# Altium project S7CAS-PLEIADES-CARTE-MERE.PrjPCB (part 2 of 3)

## Sheet CM_CLK.SchDoc
size Tabloid; SheetNumber: 8; SheetTotal: 14; Size: 11x17; Sheet_Name: CM_CLK
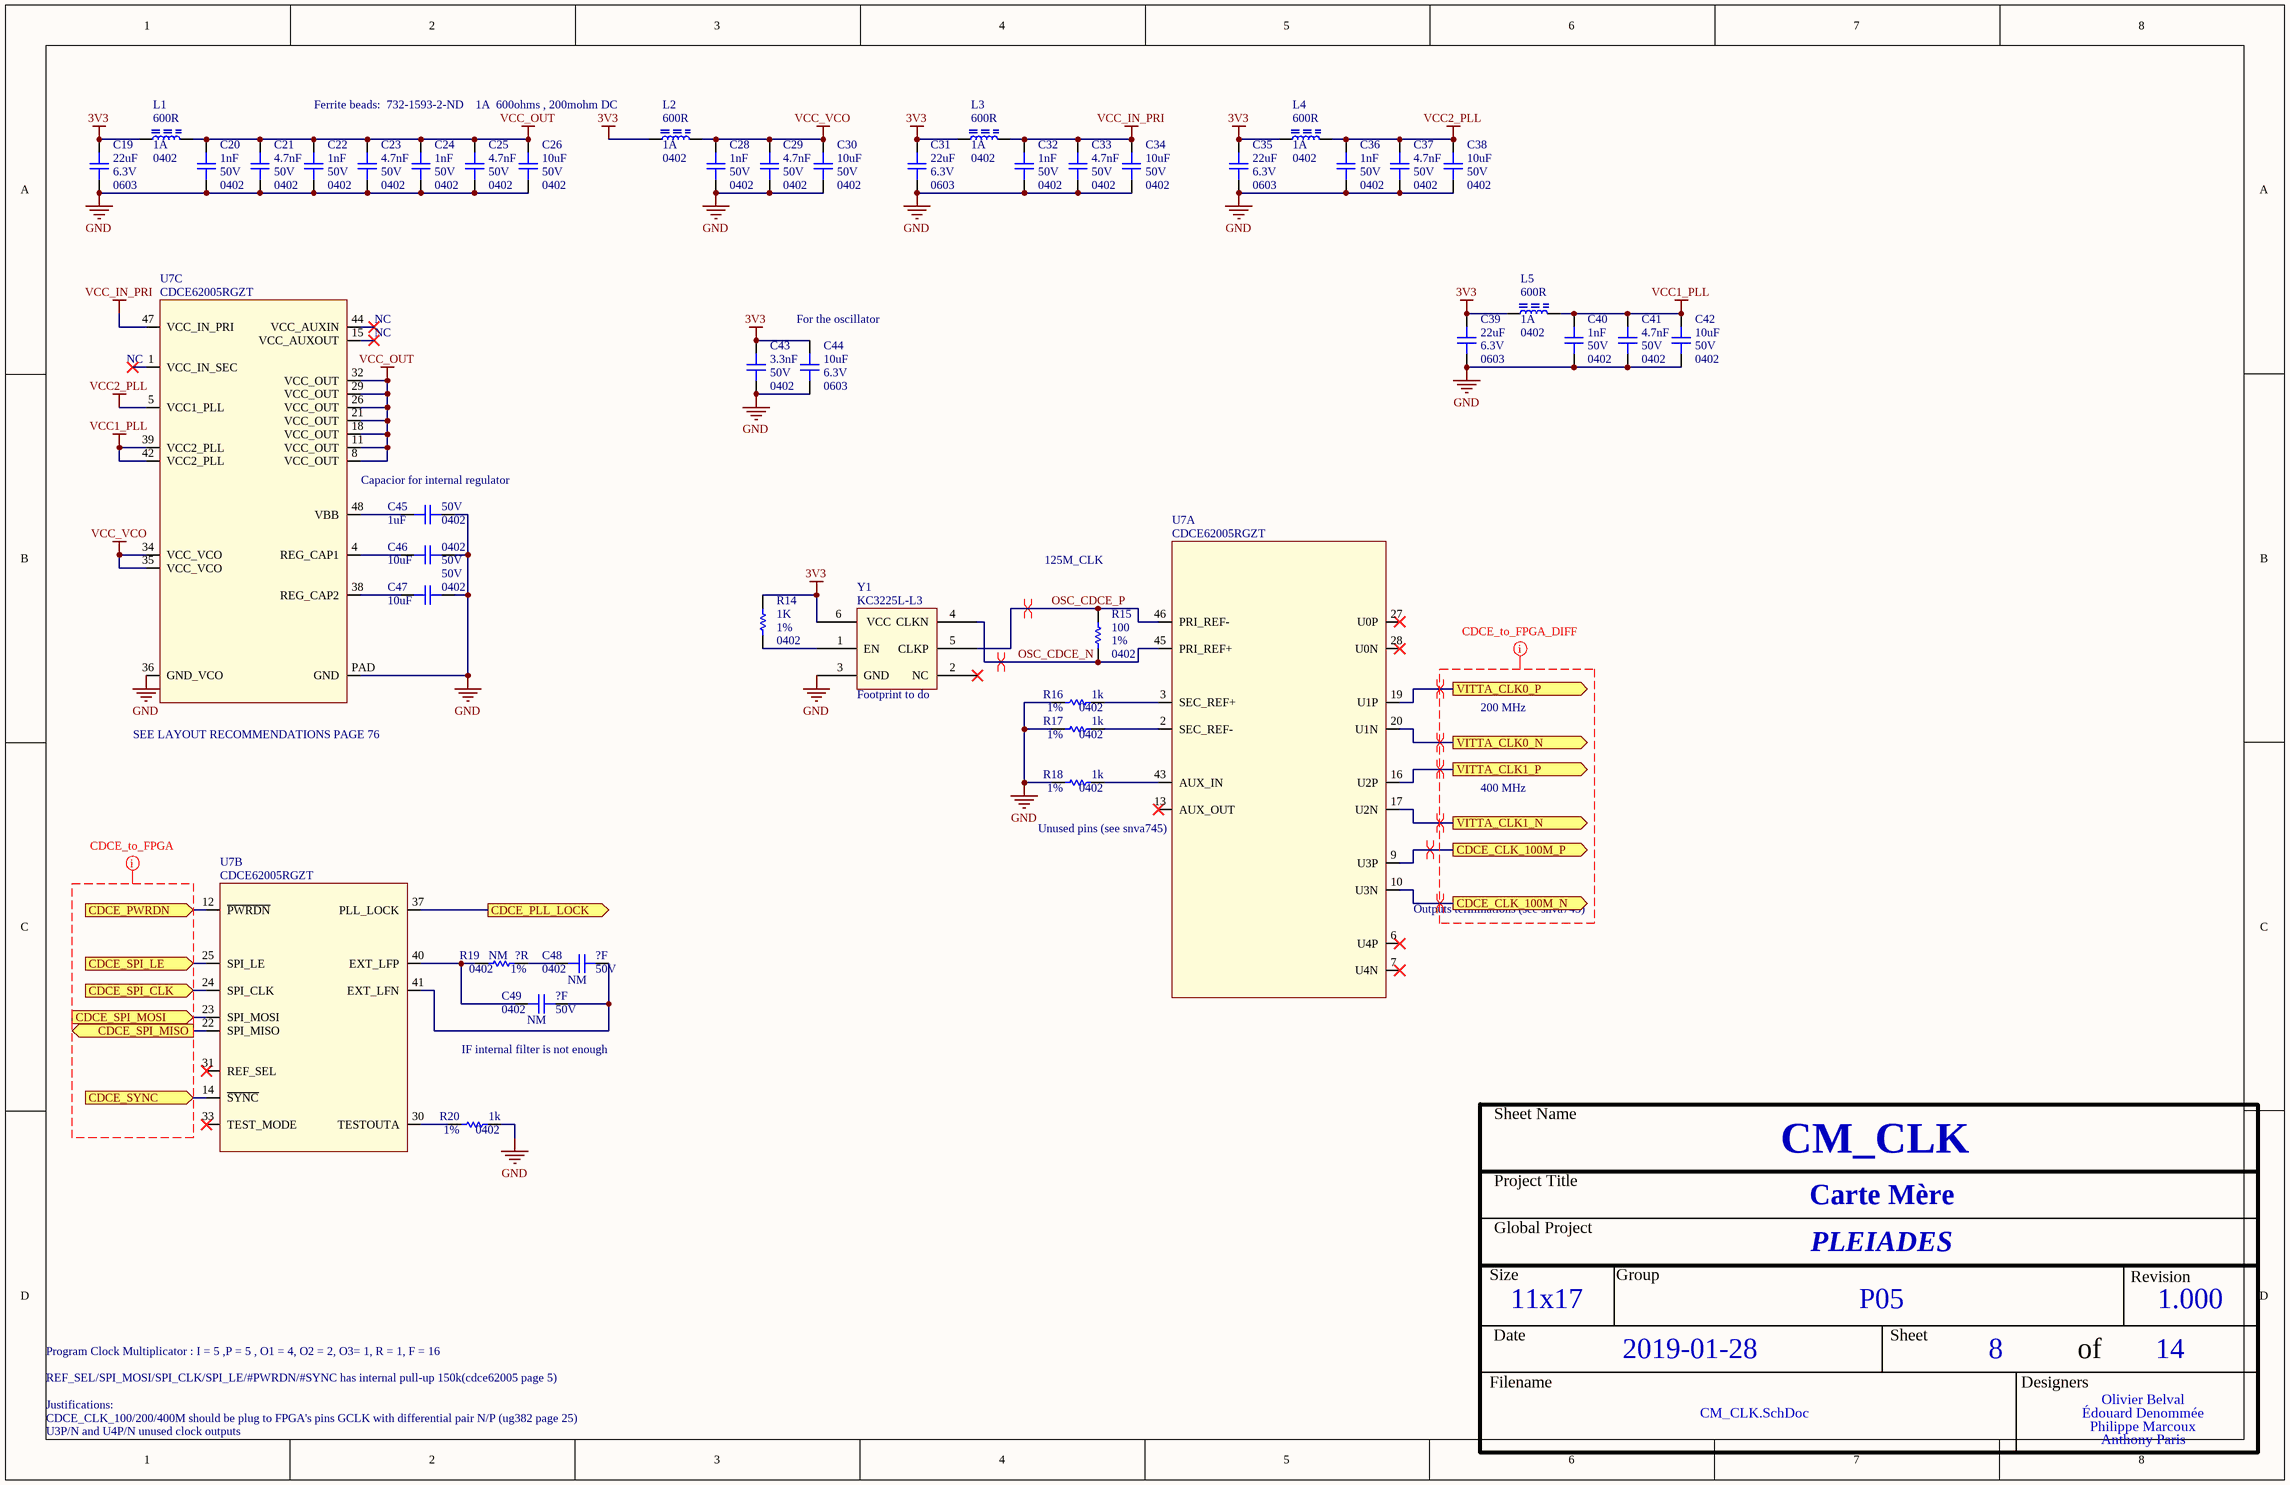
[diagram p7: CM_CLK.SchDoc]

### Parts
C19  value 22uF  Voltage: 6.3V  Package: 0603  [CAP_0603]  (hidden comment: CAP - 0603)
C20  value 1nF  Voltage: 50V  Package: 0402  [CAP_0402]  (hidden comment: CAP - 0402)
C21  value 4.7nF  Voltage: 50V  Package: 0402  [CAP_0402]  (hidden comment: CAP - 0402)
C22  value 1nF  Voltage: 50V  Package: 0402  [CAP_0402]  (hidden comment: CAP - 0402)
C23  value 4.7nF  Voltage: 50V  Package: 0402  [CAP_0402]  (hidden comment: CAP - 0402)
C24  value 1nF  Voltage: 50V  Package: 0402  [CAP_0402]  (hidden comment: CAP - 0402)
C25  value 4.7nF  Voltage: 50V  Package: 0402  [CAP_0402]  (hidden comment: CAP - 0402)
C26  value 10uF  Voltage: 50V  Package: 0402  [CAP_0402]  (hidden comment: CAP - 0402)
C28  value 1nF  Voltage: 50V  Package: 0402  [CAP_0402]  (hidden comment: CAP - 0402)
C29  value 4.7nF  Voltage: 50V  Package: 0402  [CAP_0402]  (hidden comment: CAP - 0402)
C30  value 10uF  Voltage: 50V  Package: 0402  [CAP_0402]  (hidden comment: CAP - 0402)
C31  value 22uF  Voltage: 6.3V  Package: 0603  [CAP_0603]  (hidden comment: CAP - 0603)
C32  value 1nF  Voltage: 50V  Package: 0402  [CAP_0402]  (hidden comment: CAP - 0402)
C33  value 4.7nF  Voltage: 50V  Package: 0402  [CAP_0402]  (hidden comment: CAP - 0402)
C34  value 10uF  Voltage: 50V  Package: 0402  [CAP_0402]  (hidden comment: CAP - 0402)
C35  value 22uF  Voltage: 6.3V  Package: 0603  [CAP_0603]  (hidden comment: CAP - 0603)
C36  value 1nF  Voltage: 50V  Package: 0402  [CAP_0402]  (hidden comment: CAP - 0402)
C37  value 4.7nF  Voltage: 50V  Package: 0402  [CAP_0402]  (hidden comment: CAP - 0402)
C38  value 10uF  Voltage: 50V  Package: 0402  [CAP_0402]  (hidden comment: CAP - 0402)
C39  value 22uF  Voltage: 6.3V  Package: 0603  [CAP_0603]  (hidden comment: CAP - 0603)
C40  value 1nF  Voltage: 50V  Package: 0402  [CAP_0402]  (hidden comment: CAP - 0402)
C41  value 4.7nF  Voltage: 50V  Package: 0402  [CAP_0402]  (hidden comment: CAP - 0402)
C42  value 10uF  Voltage: 50V  Package: 0402  [CAP_0402]  (hidden comment: CAP - 0402)
C43  value 3.3nF  Voltage: 50V  Package: 0402  [CAP_0402]  (hidden comment: CAP - 0402)
C44  value 10uF  Voltage: 6.3V  Package: 0603  [CAP_0603]  (hidden comment: CAP - 0603)
C45  value 1uF  Voltage: 50V  Package: 0402  [CAP_0402]  (hidden comment: CAP - 0402)
C46  value 10uF  Voltage: 50V  Package: 0402  [CAP_0402]  (hidden comment: CAP - 0402)
C47  value 10uF  Voltage: 50V  Package: 0402  [CAP_0402]  (hidden comment: CAP - 0402)
C48  NM  value ?F  Voltage: 50V  Package: 0402  [CAP_0402]
C49  NM  value ?F  Voltage: 50V  Package: 0402  [CAP_0402]
L1  value 600R  Current: 1A  Package: 0402  [FER_0402]  (hidden comment: FER - 0402)
L2  value 600R  Current: 1A  Package: 0402  [FER_0402]  (hidden comment: FER - 0402)
L3  value 600R  Current: 1A  Package: 0402  [FER_0402]  (hidden comment: FER - 0402)
L4  value 600R  Current: 1A  Package: 0402  [FER_0402]  (hidden comment: FER - 0402)
L5  value 600R  Current: 1A  Package: 0402  [FER_0402]  (hidden comment: FER - 0402)
R14  value 1K  Package: 0402  Precision: 1%  [RES_0402]  (hidden comment: RES - 0402)
R15  value 100  Package: 0402  Precision: 1%  [RES_0402]  (hidden comment: RES - 0402)
R16  value 1k  Package: 0402  Precision: 1%  [RES_0402]  (hidden comment: RES - 0402)
R17  value 1k  Package: 0402  Precision: 1%  [RES_0402]  (hidden comment: RES - 0402)
R18  value 1k  Package: 0402  Precision: 1%  [RES_0402]  (hidden comment: RES - 0402)
R19  NM  value ?R  Package: 0402  Precision: 1%  [RES_0402]
R20  value 1k  Package: 0402  Precision: 1%  [RES_0402]  (hidden comment: RES - 0402)
U7  CDCE62005RGZT  [TIM_CDCE62005RGZT]  (parts A,B,C of 3)
Y1  KC3225L-L3  [KC3225L-L3]

### Ports
CDCE_CLK_100M_N (out), CDCE_CLK_100M_P (out), CDCE_PLL_LOCK (out), CDCE_PWRDN (in), CDCE_SPI_CLK (in), CDCE_SPI_LE (in), CDCE_SPI_MISO (out), CDCE_SPI_MOSI (in), CDCE_SYNC (in), VITTA_CLK0_N (out), VITTA_CLK0_P (out), VITTA_CLK1_N (out), VITTA_CLK1_P (out)

### Nets
3V3: C19.2 C31.2 C35.2 C39.2 C43.2 C44.2 L1.2 L2.2 L3.2 L4.2 L5.2 R14.1 Y1.6(VCC)
GND: C19.1 C20.1 C21.1 C22.1 C23.1 C24.1 C25.1 C26.1 C28.1 C29.1 C30.1 C31.1 C32.1 C33.1 C34.1 C35.1 C36.1 C37.1 C38.1 C39.1 C40.1 C41.1 C42.1 C43.1 C44.1 C45.1 C46.1 C47.1 R16.2 R17.2 R18.2 R20.1 U7.36(GND_VCO) U7.PAD(GND) Y1.3(GND)
VCC1_PLL: C40.2 C41.2 C42.2 L5.1 U7.39(VCC2_PLL) U7.42(VCC2_PLL)
VCC2_PLL: C36.2 C37.2 C38.2 L4.1 U7.5(VCC1_PLL)
VCC_IN_PRI: C32.2 C33.2 C34.2 L3.1 U7.47(VCC_IN_PRI)
VCC_OUT: C20.2 C21.2 C22.2 C23.2 C24.2 C25.2 C26.2 L1.1 U7.8(VCC_OUT) U7.11(VCC_OUT) U7.18(VCC_OUT) U7.21(VCC_OUT) U7.26(VCC_OUT) U7.29(VCC_OUT) U7.32(VCC_OUT)
VCC_VCO: C28.2 C29.2 C30.2 L2.1 U7.34(VCC_VCO) U7.35(VCC_VCO)
CDCE_CLK_100M_N: U7.10(U3N) ; port CDCE_CLK_100M_N
CDCE_CLK_100M_P: U7.9(U3P) ; port CDCE_CLK_100M_P
CDCE_PLL_LOCK: U7.37(PLL_LOCK) ; port CDCE_PLL_LOCK
CDCE_PWRDN: U7.12(~{PWRDN}) ; port CDCE_PWRDN
CDCE_SPI_CLK: U7.24(SPI_CLK) ; port CDCE_SPI_CLK
CDCE_SPI_LE: U7.25(SPI_LE) ; port CDCE_SPI_LE
CDCE_SPI_MISO: U7.22(SPI_MISO) ; port CDCE_SPI_MISO
CDCE_SPI_MOSI: U7.23(SPI_MOSI) ; port CDCE_SPI_MOSI
CDCE_SYNC: U7.14(~{SYNC}) ; port CDCE_SYNC
OSC_CDCE_N: R15.2 U7.45(PRI_REF+) Y1.4(CLKN)
OSC_CDCE_P: R15.1 U7.46(PRI_REF-) Y1.5(CLKP)
VITTA_CLK0_N: U7.20(U1N) ; port VITTA_CLK0_N
VITTA_CLK0_P: U7.19(U1P) ; port VITTA_CLK0_P
VITTA_CLK1_N: U7.17(U2N) ; port VITTA_CLK1_N
VITTA_CLK1_P: U7.16(U2P) ; port VITTA_CLK1_P
NetC45_2: C45.2 U7.48(VBB)
NetC46_2: C46.2 U7.4(REG_CAP1)
NetC47_2: C47.2 U7.38(REG_CAP2)
NetC48_1: C48.1 C49.1 U7.41(EXT_LFN)
NetC48_2: C48.2 R19.1
NetC49_2: C49.2 R19.2 U7.40(EXT_LFP)
NetR14_2: R14.2 Y1.1(EN)
NetR16_1: R16.1 U7.3(SEC_REF+)
NetR17_1: R17.1 U7.2(SEC_REF-)
NetR18_1: R18.1 U7.43(AUX_IN)
NetR20_2: R20.2 U7.30(TESTOUTA)

Not connected (* = marked no-connect by the designer): U7 1(VCC_IN_SEC)* 6(U4P)* 7(U4N)* 13(AUX_OUT)* 15(VCC_AUXOUT)* 27(U0P)* 28(U0N)* 31(REF_SEL)* 33(TEST_MODE)* 44(VCC_AUXIN)*; Y1 2(NC)*

### Layout directives
differential pair: CDCE_CLK_100M_N, CDCE_CLK_100M_P, OSC_CDCE_N, OSC_CDCE_P, VITTA_CLK0_N, VITTA_CLK0_P, VITTA_CLK1_N, VITTA_CLK1_P
net class CDCE_to_FPGA: (no net found under the mark)
net class CDCE_to_FPGA_DIFF: (no net found under the mark)

### Notes on the sheet
- Ferrite beads:  732-1593-2-ND    1A  600ohms , 200mohm DC
- (near U7) NC
- (near C44) For the oscillator
- (near U7) Capacior for internal regulator
- 125M_CLK
- (near Y1) Footprint to do
- SEE LAYOUT RECOMMENDATIONS PAGE 76
- 200 MHz
- (near U7) Unused pins (see snva745)
- 400 MHz
- (near U7) Outputs terminations (see snva745)
- IF internal filter is not enough
- Program Clock Multiplicator : I = 5 ,P = 5 , O1 = 4, O2 = 2, O3= 1, R = 1, F = 16
- CDCE_CLK_100/200/400M should be plug to FPGA's pins GCLK with differential pair N/P (ug382 page 25)
- U3P/N and U4P/N unused clock outputs
- Justifications:
- REF_SEL/SPI_MOSI/SPI_CLK/SPI_LE/#PWRDN/#SYNC has internal pull-up 150k(cdce62005 page 5)
- Sheet Name
- Project Title
- Global Project
- Size
- Group
- Revision
- Date
- Sheet
- of
- Filename
- Designers

### Library data of the parts
C19 C31 C35 C39 C44 = CAP - 0603: Precision: 10%; Current: *; CreatedBy: Jonathan Bouchard; Power: *
C20-C26 C28-C30 C32-C34 C36-C38 C40-C43 C45-C49 = CAP - 0402: Precision: 10%; Current: *; CreatedBy: Jonathan Bouchard; Power: *
R14-R20 = RES - 0402: Voltage: 50V; Power: 1/16W; Current: *; CreatedBy: Jonathan Bouchard
U7 = TIM_CDCE62005RGZT: TIM - CLK SYNTH JITTER CLEANER 3:5 - QFN-48; Voltage: 3 V ~ 3.6 V; Mfg: Texas Instruments; Current: *; Power: *; Mfg Part Number: CDCE62005RGZT; HelpURL: http://www.ti.com/lit/ds/symlink/cdce62005.pdf; CreatedBy: Jonathan Bouchard; Temperature: -40°C ~ 85°C; Value: *; Precision: *; Package: QFN-48; Supplier 1: Digikey; Supplier Part Number 1: 296-23947-1-ND
L1-L5 = FER - 0402: Voltage: *; CreatedBy: Jonathan Bouchard; Power: *; Precision: *
Y1 = KC3225L-L3: datasheet: https://www.mouser.ca/datasheet/2/909/kc3225l_l2l3_e-1368039.pdf

## Sheet CM_DDR3.SchDoc
size Tabloid; SheetNumber: 9; SheetTotal: 14; Sheet_Name: CM_DDR3; Size: 11x17
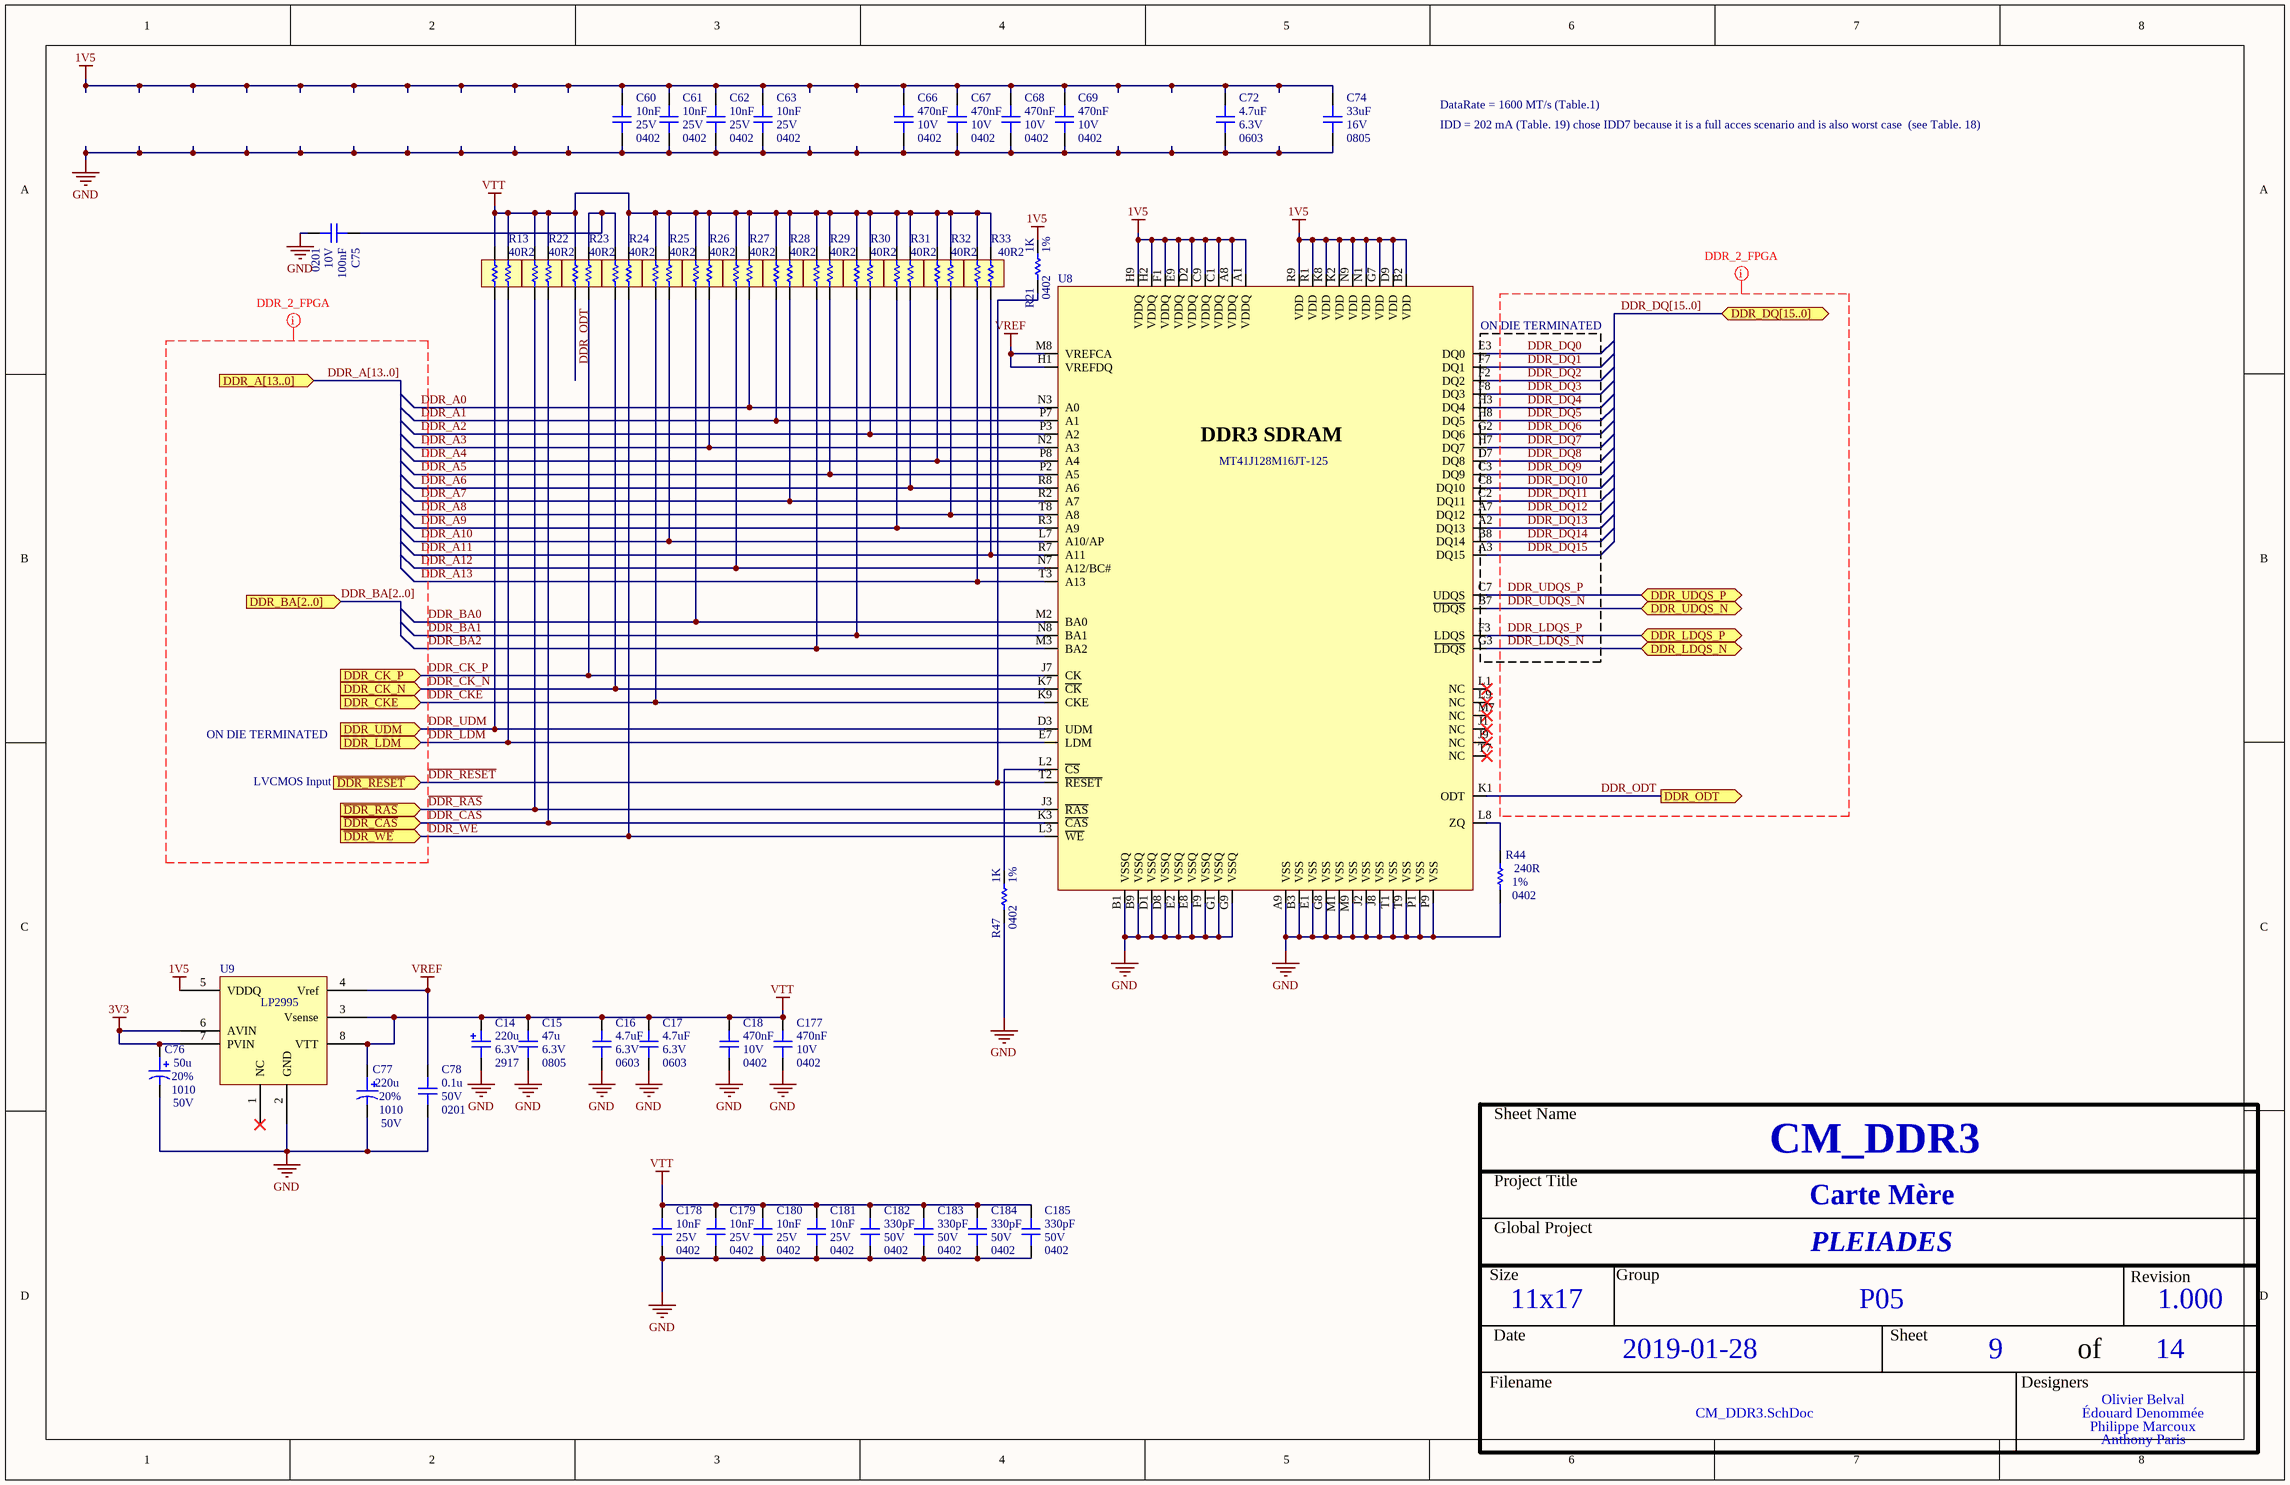
[diagram p8: CM_DDR3.SchDoc]

### Parts
C14  value 220u  Voltage: 6.3V  Package: 2917  [CAP_TAN_2917(D)]  (hidden comment: CAP - TANTALUM - CASE D)
C15  value 47u  Voltage: 6.3V  Package: 0805  [CAP_0805]  (hidden comment: CAP - 0805)
C16  value 4.7uF  Voltage: 6.3V  Package: 0603  [CAP_0603]  (hidden comment: CAP - 0603)
C17  value 4.7uF  Voltage: 6.3V  Package: 0603  [CAP_0603]  (hidden comment: CAP - 0603)
C18  value 470nF  Voltage: 10V  Package: 0402  [CAP_0402]  (hidden comment: CAP - 0402)
C60  value 10nF  Voltage: 25V  Package: 0402  [CAP_0402]  (hidden comment: CAP - 0402)
C61  value 10nF  Voltage: 25V  Package: 0402  [CAP_0402]  (hidden comment: CAP - 0402)
C62  value 10nF  Voltage: 25V  Package: 0402  [CAP_0402]  (hidden comment: CAP - 0402)
C63  value 10nF  Voltage: 25V  Package: 0402  [CAP_0402]  (hidden comment: CAP - 0402)
C66  value 470nF  Voltage: 10V  Package: 0402  [CAP_0402]  (hidden comment: CAP - 0402)
C67  value 470nF  Voltage: 10V  Package: 0402  [CAP_0402]  (hidden comment: CAP - 0402)
C68  value 470nF  Voltage: 10V  Package: 0402  [CAP_0402]  (hidden comment: CAP - 0402)
C69  value 470nF  Voltage: 10V  Package: 0402  [CAP_0402]  (hidden comment: CAP - 0402)
C72  value 4.7uF  Voltage: 6.3V  Package: 0603  [CAP_0603]  (hidden comment: CAP - 0603)
C74  value 33uF  Voltage: 16V  Package: 0805  [CAP_0805]  (hidden comment: CAP - 0805)
C75  value 100nF  Voltage: 10V  Package: 0201  [CAP_0201]  (hidden comment: CAP - 0201)
C76  value 50u  Voltage: 50V  Package: 1010  Precision: 20%  [CAP_ALU_1010_vishay]  (hidden comment: MAL215099101E3)
C77  value 220u  Voltage: 50V  Package: 1010  Precision: 20%  [CAP_ALU_1010_vishay]  (hidden comment: MAL215099101E3)
C78  value 0.1u  Voltage: 50V  Package: 0201  [CAP_0201]  (hidden comment: CAP - 0201)
C177  value 470nF  Voltage: 10V  Package: 0402  [CAP_0402]  (hidden comment: CAP - 0402)
C178  value 10nF  Voltage: 25V  Package: 0402  [CAP_0402]  (hidden comment: CAP - 0402)
C179  value 10nF  Voltage: 25V  Package: 0402  [CAP_0402]  (hidden comment: CAP - 0402)
C180  value 10nF  Voltage: 25V  Package: 0402  [CAP_0402]  (hidden comment: CAP - 0402)
C181  value 10nF  Voltage: 25V  Package: 0402  [CAP_0402]  (hidden comment: CAP - 0402)
C182  value 330pF  Voltage: 50V  Package: 0402  [CAP_0402]  (hidden comment: CAP - 0402)
C183  value 330pF  Voltage: 50V  Package: 0402  [CAP_0402]  (hidden comment: CAP - 0402)
C184  value 330pF  Voltage: 50V  Package: 0402  [CAP_0402]  (hidden comment: CAP - 0402)
C185  value 330pF  Voltage: 50V  Package: 0402  [CAP_0402]  (hidden comment: CAP - 0402)
R13  value 40R2  [CAT16-J2]  (hidden comment: Double resistor)
R21  value 1K  Package: 0402  Precision: 1%  [RES_0402]  (hidden comment: RES - 0402)
R22  value 40R2  [CAT16-J2]  (hidden comment: Double resistor)
R23  value 40R2  [CAT16-J2]  (hidden comment: Double resistor)
R24  value 40R2  [CAT16-J2]  (hidden comment: Double resistor)
R25  value 40R2  [CAT16-J2]  (hidden comment: Double resistor)
R26  value 40R2  [CAT16-J2]  (hidden comment: Double resistor)
R27  value 40R2  [CAT16-J2]  (hidden comment: Double resistor)
R28  value 40R2  [CAT16-J2]  (hidden comment: Double resistor)
R29  value 40R2  [CAT16-J2]  (hidden comment: Double resistor)
R30  value 40R2  [CAT16-J2]  (hidden comment: Double resistor)
R31  value 40R2  [CAT16-J2]  (hidden comment: Double resistor)
R32  value 40R2  [CAT16-J2]  (hidden comment: Double resistor)
R33  value 40R2  [CAT16-J2]  (hidden comment: Double resistor)
R44  value 240R  Package: 0402  Precision: 1%  [RES_0402]  (hidden comment: RES - 0402)
R47  value 1K  Package: 0402  Precision: 1%  [RES_0402]  (hidden comment: RES - 0402)
U8  MT41J128M16JT-125  [MEM_DDR3_MT41J128M16JT-125]
U9  LP2995  [SOP8]

### Ports
DDR_A[13..0] (in), DDR_BA[2..0] (in), DDR_CK_N (in), DDR_CK_P (in), DDR_CKE (in), DDR_DQ[15..0] (bidir), DDR_LDM (in), DDR_LDQS_N (bidir), DDR_LDQS_P (bidir), DDR_ODT (out), DDR_UDM (in), DDR_UDQS_N (bidir), DDR_UDQS_P (bidir), ~{DDR_CAS} (in), ~{DDR_RAS} (in), ~{DDR_RESET} (in), ~{DDR_WE} (in)

### Nets
1V5: C60.2 C61.2 C62.2 C63.2 C66.2 C67.2 C68.2 C69.2 C72.2 C74.2 R21.2 U8.A1(VDDQ) U8.A8(VDDQ) U8.B2(VDD) U8.C1(VDDQ) U8.C9(VDDQ) U8.D2(VDDQ) U8.D9(VDD) U8.E9(VDDQ) U8.F1(VDDQ) U8.G7(VDD) U8.H2(VDDQ) U8.H9(VDDQ) U8.K2(VDD) U8.K8(VDD) U8.N1(VDD) U8.N9(VDD) U8.R1(VDD) U8.R9(VDD) U9.5(VDDQ)
3V3: C76.1 U9.6(AVIN) U9.7(PVIN)
GND: C14.1 C15.1 C16.1 C17.1 C18.1 C60.1 C61.1 C62.1 C63.1 C66.1 C67.1 C68.1 C69.1 C72.1 C74.1 C75.1 C76.2 C77.2 C78.1 C177.1 C178.1 C179.1 C180.1 C181.1 C182.1 C183.1 C184.1 C185.1 R44.1 R47.1 U8.A9(VSS) U8.B1(VSSQ) U8.B3(VSS) U8.B9(VSSQ) U8.D1(VSSQ) U8.D8(VSSQ) U8.E1(VSS) U8.E2(VSSQ) U8.E8(VSSQ) U8.F9(VSSQ) U8.G1(VSSQ) U8.G8(VSS) U8.G9(VSSQ) U8.J2(VSS) U8.J8(VSS) U8.M1(VSS) U8.M9(VSS) U8.P1(VSS) U8.P9(VSS) U8.T1(VSS) U8.T9(VSS) U9.2(GND)
VREF: C78.2 U8.H1(VREFDQ) U8.M8(VREFCA) U9.4(Vref)
VTT: C14.2 C15.2 C16.2 C17.2 C18.2 C77.1 C177.2 C178.2 C179.2 C180.2 C181.2 C182.2 C183.2 C184.2 C185.2 R13.3 R13.4 R22.3 R22.4 R23.4 R24.3 R25.3 R25.4 R26.3 R26.4 R27.3 R27.4 R28.3 R28.4 R29.3 R29.4 R30.3 R30.4 R31.3 R31.4 R32.3 R32.4 R33.3 R33.4 U9.3(Vsense) U9.8(VTT)
~{DDR_CAS}: R22.2 U8.K3(~{CAS}) ; port ~{DDR_CAS}
~{DDR_RAS}: R22.1 U8.J3(~{RAS}) ; port ~{DDR_RAS}
~{DDR_RESET}: R21.1 U8.T2(~{RESET}) ; port ~{DDR_RESET}
~{DDR_WE}: R24.2 U8.L3(~{WE}) ; port ~{DDR_WE}
DDR_A0: R27.2 U8.N3(A0)
DDR_A1: R28.1 U8.P7(A1)
DDR_A2: R30.2 U8.P3(A2)
DDR_A3: R26.2 U8.N2(A3)
DDR_A4: R32.1 U8.P8(A4)
DDR_A5: R29.2 U8.P2(A5)
DDR_A6: R31.2 U8.R8(A6)
DDR_A7: R28.2 U8.R2(A7)
DDR_A8: R32.2 U8.T8(A8)
DDR_A9: R31.1 U8.R3(A9)
DDR_A10: R25.2 U8.L7(A10/AP)
DDR_A11: R33.2 U8.R7(A11)
DDR_A12: R27.1 U8.N7(A12/BC#)
DDR_A13: R33.1 U8.T3(A13)
DDR_BA0: R26.1 U8.M2(BA0)
DDR_BA1: R30.1 U8.N8(BA1)
DDR_BA2: R29.1 U8.M3(BA2)
DDR_CK_N: R24.1 U8.K7(~{CK}) ; port DDR_CK_N
DDR_CK_P: R23.2 U8.J7(CK) ; port DDR_CK_P
DDR_CKE: R25.1 U8.K9(CKE) ; port DDR_CKE
DDR_DQ0: U8.E3(DQ0)
DDR_DQ1: U8.F7(DQ1)
DDR_DQ2: U8.F2(DQ2)
DDR_DQ3: U8.F8(DQ3)
DDR_DQ4: U8.H3(DQ4)
DDR_DQ5: U8.H8(DQ5)
DDR_DQ6: U8.G2(DQ6)
DDR_DQ7: U8.H7(DQ7)
DDR_DQ8: U8.D7(DQ8)
DDR_DQ9: U8.C3(DQ9)
DDR_DQ10: U8.C8(DQ10)
DDR_DQ11: U8.C2(DQ11)
DDR_DQ12: U8.A7(DQ12)
DDR_DQ13: U8.A2(DQ13)
DDR_DQ14: U8.B8(DQ14)
DDR_DQ15: U8.A3(DQ15)
DDR_LDM: R13.2 U8.E7(LDM) ; port DDR_LDM
DDR_LDQS_N: U8.G3(~{LDQS}) ; port DDR_LDQS_N
DDR_LDQS_P: U8.F3(LDQS) ; port DDR_LDQS_P
DDR_ODT: R23.1 U8.K1(ODT) ; port DDR_ODT
DDR_UDM: R13.1 U8.D3(UDM) ; port DDR_UDM
DDR_UDQS_N: U8.B7(~{UDQS}) ; port DDR_UDQS_N
DDR_UDQS_P: U8.C7(UDQS) ; port DDR_UDQS_P
NetC75_2: C75.2 R23.3 R24.4
NetR44_2: R44.2 U8.L8(ZQ)
NetR47_2: R47.2 U8.L2(~{CS})

Not connected (* = marked no-connect by the designer): U8 J1(NC)* J9(NC)* L1(NC)* L9(NC)* M7(NC)* T7(NC)*; U9 1(NC)*

### Buses and harness runs
bus DDR_A[13..0] = port DDR_A[13..0]
bus DDR_BA[2..0] = port DDR_BA[2..0]
bus DDR_DQ[15..0] = port DDR_DQ[15..0]

### Layout directives
net class DDR_2_FPGA: DDR_A0, DDR_A1, DDR_A2, DDR_A3, DDR_A4, DDR_A5, DDR_A6, DDR_A7, DDR_A8, DDR_A9, DDR_A10, DDR_A11, DDR_A12, DDR_A13, DDR_A[13..0], DDR_BA0, DDR_BA1, DDR_BA2, DDR_BA[2..0], DDR_CK_N, DDR_CK_P, DDR_CKE, DDR_DQ0, DDR_DQ1, DDR_DQ2, DDR_DQ3, DDR_DQ4, DDR_DQ5, DDR_DQ6, DDR_DQ7, DDR_DQ8, DDR_DQ9, DDR_DQ10, DDR_DQ11, DDR_DQ12, DDR_DQ13, DDR_DQ14, DDR_DQ15, DDR_DQ[15..0], DDR_LDM, DDR_LDQS_N, DDR_LDQS_P, DDR_ODT, DDR_UDM, DDR_UDQS_N, DDR_UDQS_P, ~{DDR_CAS}, ~{DDR_RAS}, ~{DDR_RESET}, ~{DDR_WE}

### Notes on the sheet
- DataRate = 1600 MT/s (Table.1)
- IDD = 202 mA (Table. 19) chose IDD7 because it is a full acces scenario and is also worst case  (see Table. 18)
- (near U8) ON DIE TERMINATED
- ON DIE TERMINATED
- LVCMOS Input
- Sheet Name
- Project Title
- Global Project
- Size
- Group
- Revision
- Date
- Sheet
- of
- Filename
- Designers
- (in symbol MEM_DDR3_MT41J128M16JT-125:K TR) DDR3 SDRAM

### Library data of the parts
C14 = CAP_TANT_2917(D): CAP - TANTALUM - 2917; Precision: 10%; Current: *; CreatedBy: Jonathan Bouchard; Power: *
C15 C74 = CAP - 0805: Precision: 10%; Current: *; CreatedBy: Jonathan Bouchard; Power: *
C16 C17 C72 = CAP - 0603: Precision: 10%; Current: *; CreatedBy: Jonathan Bouchard; Power: *
C18 C60-C63 C66-C69 C177-C185 = CAP - 0402: Precision: 10%; Current: *; CreatedBy: Jonathan Bouchard; Power: *
C75 C78 = CAP - 0201: Precision: 10%; Current: *; CreatedBy: Jonathan Bouchard; Power: *
C76 C77 = CAP_ALU_MAL215099101E3: CAP - ALU 100uF 20% 50V - 1010; Current: 490mA; Mfg: Vishay Dale; Mfg Part Number: MAL215099101E3; HelpURL: http://www.vishay.com/docs/28395/150crz.pdf; CreatedBy: Jonathan Bouchard; Temperature: -55°C to 125°C; Power: *; Supplier 1: Digikey; Supplier Part Number 1: 4399PHDKR-ND
R21 R44 R47 = RES - 0402: Voltage: 50V; Power: 1/16W; Current: *; CreatedBy: Jonathan Bouchard
U8 = MEM_DDR3_MT41J128M16JT-125:K TR: MEM - DDR3 SDRAM 2GBIT 800MHZ - TFBGA-96; Voltage: 1.425 V ~ 1.575 V; Mfg: Micrel; Current: *; Power: *; Mfg Part Number: http://www.micron.com/~/media/Documents/Products/Data%20Sheet/DRAM/DDR3/2Gb_DDR3_SDRAM.pdf; HelpURL: http://ww1.microchip.com/downloads/en/DeviceDoc/00002275A.pdf; CreatedBy: Jonathan Bouchard; Temperature: 0°C ~ 95°C (TC); Value: *; Precision: *; Package: TFBGA-96; Supplier 1: Digikey; Supplier Part Number 1: 557-1611-1-ND

## Sheet CM_MOTOR.SchDoc
size Tabloid; SheetNumber: 10; SheetTotal: 14; Sheet_Name: CM_MOTOR; Size: 11x17
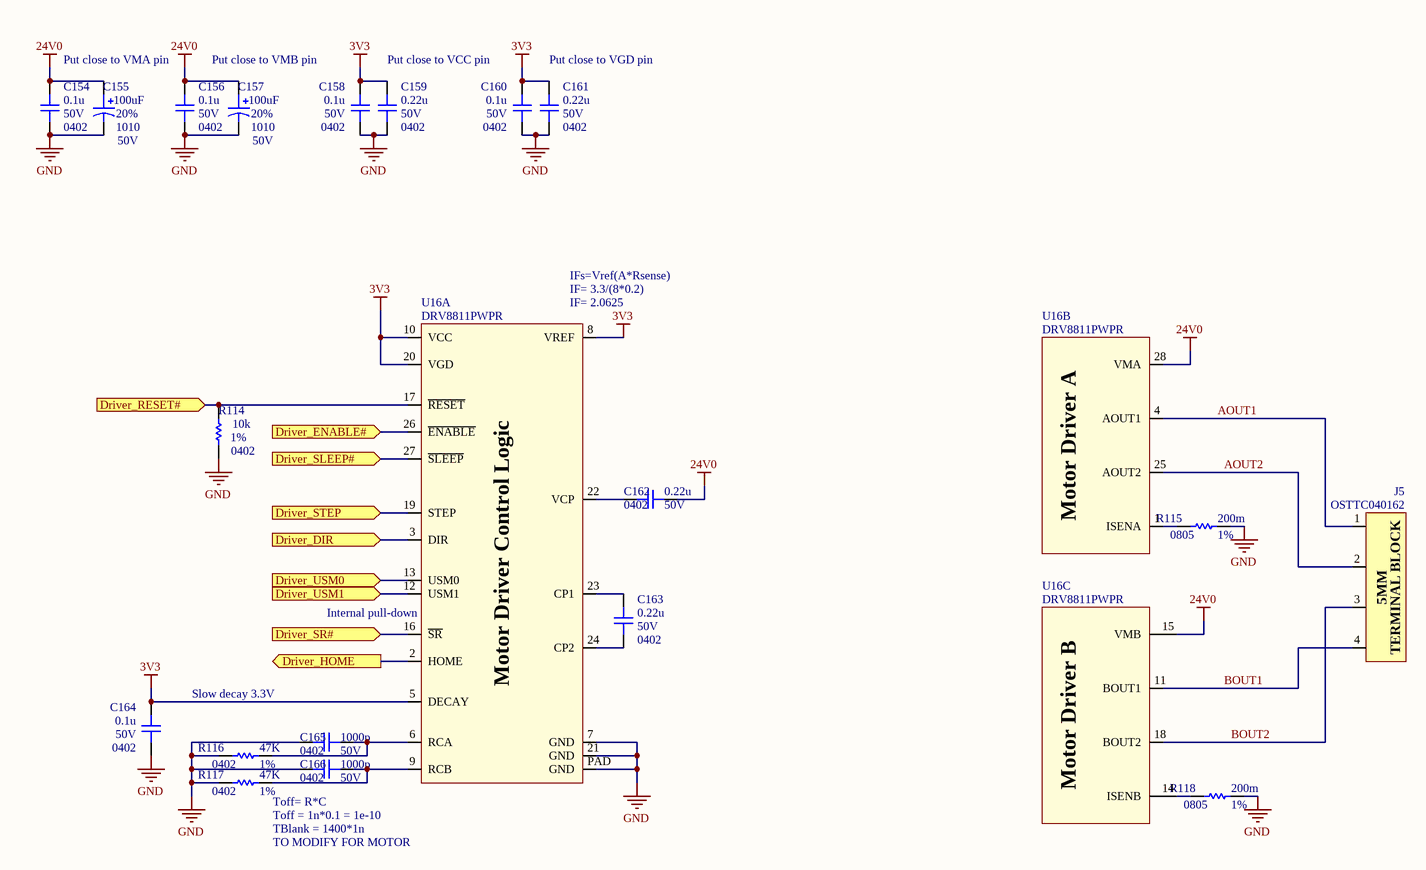
[diagram p9: CM_MOTOR.SchDoc]

### Parts
C154  value 0.1u  Voltage: 50V  Package: 0402  [CAP_0402]  (hidden comment: CAP - 0402)
C155  value 100uF  Voltage: 50V  Package: 1010  Precision: 20%  [CAP_ALU_1010_vishay]  (hidden comment: MAL215099101E3)
C156  value 0.1u  Voltage: 50V  Package: 0402  [CAP_0402]  (hidden comment: CAP - 0402)
C157  value 100uF  Voltage: 50V  Package: 1010  Precision: 20%  [CAP_ALU_1010_vishay]  (hidden comment: MAL215099101E3)
C158  value 0.1u  Voltage: 50V  Package: 0402  [CAP_0402]  (hidden comment: CAP - 0402)
C159  value 0.22u  Voltage: 50V  Package: 0402  [CAP_0402]  (hidden comment: CAP - 0402)
C160  value 0.1u  Voltage: 50V  Package: 0402  [CAP_0402]  (hidden comment: CAP - 0402)
C161  value 0.22u  Voltage: 50V  Package: 0402  [CAP_0402]  (hidden comment: CAP - 0402)
C162  value 0.22u  Voltage: 50V  Package: 0402  [CAP_0402]  (hidden comment: CAP - 0402)
C163  value 0.22u  Voltage: 50V  Package: 0402  [CAP_0402]  (hidden comment: CAP - 0402)
C164  value 0.1u  Voltage: 50V  Package: 0402  [CAP_0402]  (hidden comment: CAP - 0402)
C165  value 1000p  Voltage: 50V  Package: 0402  [CAP_0402]  (hidden comment: CAP - 0402)
C166  value 1000p  Voltage: 50V  Package: 0402  [CAP_0402]  (hidden comment: CAP - 0402)
J5  OSTTC040162  [CONN_TERMINAL_OSTTA040161]
R114  value 10k  Package: 0402  Precision: 1%  [RES_0402]  (hidden comment: RES - 0402)
R115  value 200m  Package: 0805  Precision: 1%  [RES_0402]  (hidden comment: RES - 0402)
R116  value 47K  Package: 0402  Precision: 1%  [RES_0402]  (hidden comment: RES - 0402)
R117  value 47K  Package: 0402  Precision: 1%  [RES_0402]  (hidden comment: RES - 0402)
R118  value 200m  Package: 0805  Precision: 1%  [RES_0402]  (hidden comment: RES - 0402)
U16  DRV8811PWPR  [POW_MOTOR_DRV8811PWPR]  (parts A,B,C of 3)

### Ports
Driver_DIR (in), Driver_ENABLE# (in), Driver_HOME (out), Driver_RESET# (in), Driver_SLEEP# (in), Driver_SR# (in), Driver_STEP (in), Driver_USM0 (in), Driver_USM1 (in)

### Nets
3V3: C158.2 C159.2 C160.2 C161.2 C164.2 U16.5(DECAY) U16.8(VREF) U16.10(VCC) U16.20(VGD)
24V0: C154.2 C155.1 C156.2 C157.1 C162.2 U16.15(VMB) U16.28(VMA)
GND: C154.1 C155.2 C156.1 C157.2 C158.1 C159.1 C160.1 C161.1 C164.1 C165.2 C166.2 R114.1 R115.2 R116.1 R117.1 R118.2 U16.7(GND) U16.21(GND) U16.PAD(GND)
AOUT1: J5.1 U16.4(AOUT1)
AOUT2: J5.2 U16.25(AOUT2)
BOUT1: J5.4 U16.11(BOUT1)
BOUT2: J5.3 U16.18(BOUT2)
Driver_DIR: U16.3(DIR) ; port Driver_DIR
Driver_ENABLE#: U16.26(~{ENABLE}) ; port Driver_ENABLE#
Driver_HOME: U16.2(HOME) ; port Driver_HOME
Driver_RESET#: R114.2 U16.17(~{RESET}) ; port Driver_RESET#
Driver_SLEEP#: U16.27(~{SLEEP}) ; port Driver_SLEEP#
Driver_SR#: U16.16(~{SR}) ; port Driver_SR#
Driver_STEP: U16.19(STEP) ; port Driver_STEP
Driver_USM0: U16.13(USM0) ; port Driver_USM0
Driver_USM1: U16.12(USM1) ; port Driver_USM1
NetC162_1: C162.1 U16.22(VCP)
NetC163_1: C163.1 U16.24(CP2)
NetC163_2: C163.2 U16.23(CP1)
NetC165_1: C165.1 R116.2 U16.6(RCA)
NetC166_1: C166.1 R117.2 U16.9(RCB)
NetR115_1: R115.1 U16.1(ISENA)
NetR118_1: R118.1 U16.14(ISENB)

### Notes on the sheet
- Put close to VMA pin
- Put close to VMB pin
- Put close to VCC pin
- Put close to VGD pin
- IFs=Vref(A*Rsense)
- (near U16) IF= 3.3/(8*0.2)
- (near U16) IF= 2.0625
- (near U16) Internal pull-down
- Slow decay 3.3V
- Toff= R*C
- Toff = 1n*0.1 = 1e-10
- TBlank = 1400*1n
- TO MODIFY FOR MOTOR
- Sheet Name
- Project Title
- Global Project
- Size
- Group
- Revision
- Date
- Sheet
- of
- Filename
- Designers
- (in symbol CONN_TERMINAL_OSTTC040162) 5MM; TERMINAL BLOCK
- (in symbol POW_MOTOR_DRV8811PWPR, part A) Motor Driver Control Logic
- (in symbol POW_MOTOR_DRV8811PWPR, part B) Motor Driver A
- (in symbol POW_MOTOR_DRV8811PWPR, part C) Motor Driver B

### Library data of the parts
C154 C156 C158-C166 = CAP - 0402: Precision: 10%; Current: *; CreatedBy: Jonathan Bouchard; Power: *
C155 C157 = CAP_ALU_MAL215099101E3: as C76 on sheet CM_DDR3; Mfg Part Number: MAL215099101E3; HelpURL: http://www.vishay.com/docs/28395/150crz.pdf; CreatedBy: Jonathan Bouchard; Temperature: -55°C to 125°C; Power: *; Supplier 1: Digikey; Supplier Part Number 1: 4399PHDKR-ND
J5 = CONN_TERMINAL_OSTTC040162: CONN -  TERMINAL BLOCK 4POS 5MM - TH; Mfg: On Shore Technology Inc.; Voltage: *; Current: *; Power: *; Mfg Part Number: OSTTC040162; HelpURL: http://www.on-shore.com/wp-content/uploads/2015/09/osttcxx0162.pdf; CreatedBy: Jonathan Bouchard; Temperature: -30°C ~ 105°C; Value: *; Precision: *; Package: TH-4; Supplier 1: Digikey; Supplier Part Number 1: ED2602-ND
R114-R118 = RES - 0402: Voltage: 50V; Power: 1/16W; Current: *; CreatedBy: Jonathan Bouchard
U16 = POW_MOTOR_DRV8811PWPR: POW - STEPPER MOTOR DRIVER - SOP-28; Voltage: 3 V ~ 5.5 V / 8 V ~ 38 V; Mfg: Texas Instrument; Current: *; Power: *; Mfg Part Number: DRV8811PWPR; HelpURL: http://www.ti.com/lit/ds/symlink/drv8811.pdf; CreatedBy: Jonathan Bouchard; Temperature: -40°C ~ 150°C (TJ); Value: *; Precision: *; Package: SOP-28; Supplier 1: Digikey; Supplier Part Number 1: 296-24591-1-ND

## Sheet CM_ETHERNET.SchDoc
size Tabloid; SheetNumber: 11; SheetTotal: 14; Sheet_Name: CM_ETHERNET; Size: 11x17
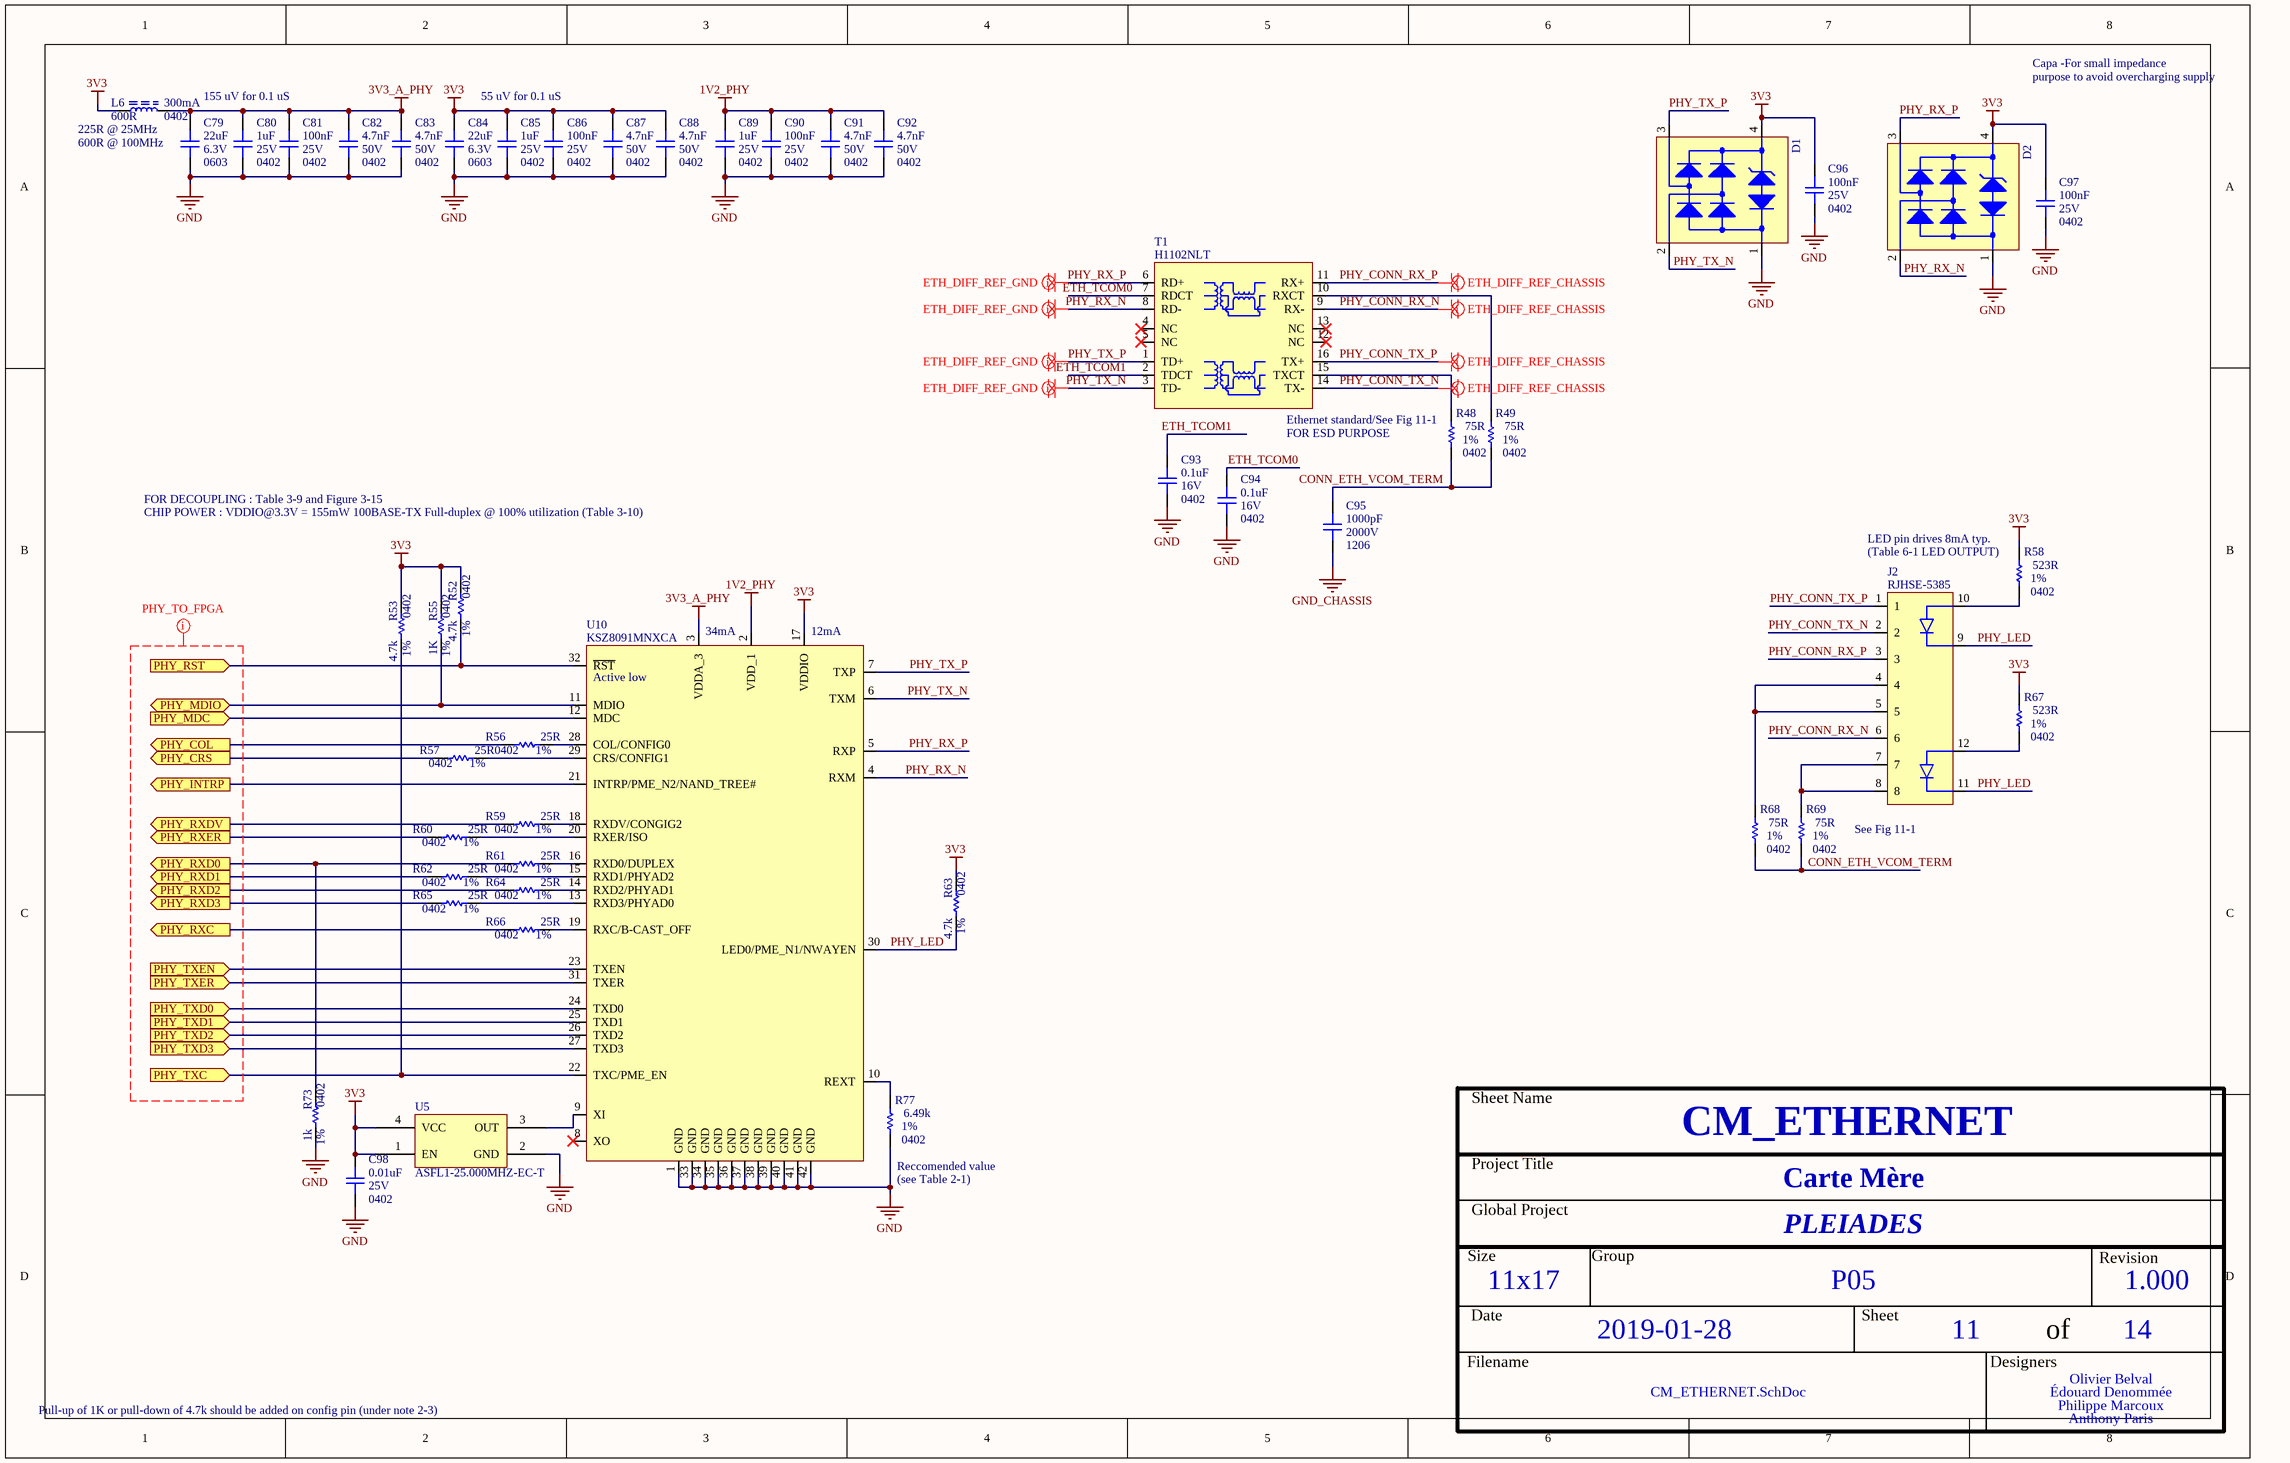
[diagram p10: CM_ETHERNET.SchDoc]

### Parts
C79  value 22uF  Voltage: 6.3V  Package: 0603  [CAP_0603]  (hidden comment: CAP - 0603)
C80  value 1uF  Voltage: 25V  Package: 0402  [CAP_0402]  (hidden comment: CAP - 0402)
C81  value 100nF  Voltage: 25V  Package: 0402  [CAP_0402]  (hidden comment: CAP - 0402)
C82  value 4.7nF  Voltage: 50V  Package: 0402  [CAP_0402]  (hidden comment: CAP - 0402)
C83  value 4.7nF  Voltage: 50V  Package: 0402  [CAP_0402]  (hidden comment: CAP - 0402)
C84  value 22uF  Voltage: 6.3V  Package: 0603  [CAP_0603]  (hidden comment: CAP - 0603)
C85  value 1uF  Voltage: 25V  Package: 0402  [CAP_0402]  (hidden comment: CAP - 0402)
C86  value 100nF  Voltage: 25V  Package: 0402  [CAP_0402]  (hidden comment: CAP - 0402)
C87  value 4.7nF  Voltage: 50V  Package: 0402  [CAP_0402]  (hidden comment: CAP - 0402)
C88  value 4.7nF  Voltage: 50V  Package: 0402  [CAP_0402]  (hidden comment: CAP - 0402)
C89  value 1uF  Voltage: 25V  Package: 0402  [CAP_0402]  (hidden comment: CAP - 0402)
C90  value 100nF  Voltage: 25V  Package: 0402  [CAP_0402]  (hidden comment: CAP - 0402)
C91  value 4.7nF  Voltage: 50V  Package: 0402  [CAP_0402]  (hidden comment: CAP - 0402)
C92  value 4.7nF  Voltage: 50V  Package: 0402  [CAP_0402]  (hidden comment: CAP - 0402)
C93  value 0.1uF  Voltage: 16V  Package: 0402  [CAP_0402]  (hidden comment: CAP - 0402)
C94  value 0.1uF  Voltage: 16V  Package: 0402  [CAP_0402]  (hidden comment: CAP - 0402)
C95  value 1000pF  Voltage: 2000V  Package: 1206  [CAP_1206]  (hidden comment: CAP - 1206)
C96  value 100nF  Voltage: 25V  Package: 0402  [CAP_0402]  (hidden comment: CAP - 0402)
C97  value 100nF  Voltage: 25V  Package: 0402  [CAP_0402]  (hidden comment: CAP - 0402)
C98  value 0.01uF  Voltage: 25V  Package: 0402  [CAP_0402]  (hidden comment: CAP - 0402)
D1  SR3.3.TCT  [TVS_SR3.3.TCT]  (value not drawn)
D2  SR3.3.TCT  [TVS_SR3.3.TCT]  (value not drawn)
J2  RJHSE-5385  [CONN_ETHERNET_RJHSE-5385]
L6  value 600R  Current: 300mA  Package: 0402  [FER_0402]  (hidden comment: FER - 0402)
R48  value 75R  Package: 0402  Precision: 1%  [RES_0402]  (hidden comment: RES - 0402)
R49  value 75R  Package: 0402  Precision: 1%  [RES_0402]  (hidden comment: RES - 0402)
R52  value 4.7k  Package: 0402  Precision: 1%  [RES_0402]  (hidden comment: RES - 0402)
R53  value 4.7k  Package: 0402  Precision: 1%  [RES_0402]  (hidden comment: RES - 0402)
R55  value 1K  Package: 0402  Precision: 1%  [RES_0402]  (hidden comment: RES - 0402)
R56  value 25R  Package: 0402  Precision: 1%  [RES_0402]  (hidden comment: RES - 0402)
R57  value 25R  Package: 0402  Precision: 1%  [RES_0402]  (hidden comment: RES - 0402)
R58  value 523R  Package: 0402  Precision: 1%  [RES_0402]  (hidden comment: RES - 0402)
R59  value 25R  Package: 0402  Precision: 1%  [RES_0402]  (hidden comment: RES - 0402)
R60  value 25R  Package: 0402  Precision: 1%  [RES_0402]  (hidden comment: RES - 0402)
R61  value 25R  Package: 0402  Precision: 1%  [RES_0402]  (hidden comment: RES - 0402)
R62  value 25R  Package: 0402  Precision: 1%  [RES_0402]  (hidden comment: RES - 0402)
R63  value 4.7k  Package: 0402  Precision: 1%  [RES_0402]  (hidden comment: RES - 0402)
R64  value 25R  Package: 0402  Precision: 1%  [RES_0402]  (hidden comment: RES - 0402)
R65  value 25R  Package: 0402  Precision: 1%  [RES_0402]  (hidden comment: RES - 0402)
R66  value 25R  Package: 0402  Precision: 1%  [RES_0402]  (hidden comment: RES - 0402)
R67  value 523R  Package: 0402  Precision: 1%  [RES_0402]  (hidden comment: RES - 0402)
R68  value 75R  Package: 0402  Precision: 1%  [RES_0402]  (hidden comment: RES - 0402)
R69  value 75R  Package: 0402  Precision: 1%  [RES_0402]  (hidden comment: RES - 0402)
R73  value 1k  Package: 0402  Precision: 1%  [RES_0402]  (hidden comment: RES - 0402)
R77  value 6.49k  Package: 0402  Precision: 1%  [RES_0402]  (hidden comment: RES - 0402)
T1  H1102NLT  [TRANSFO_H1102NLT]
U5  ASFL1-25.000MHZ-EC-T  [ASFL1]
U10  KSZ8091MNXCA  [COM_ETH_PHY_KSZ8091MNXCA]

### Ports
PHY_COL (out), PHY_CRS (out), PHY_INTRP (out), PHY_MDC (in), PHY_MDIO (bidir), PHY_RST (in), PHY_RXC (out), PHY_RXD0 (out), PHY_RXD1 (out), PHY_RXD2 (out), PHY_RXD3 (out), PHY_RXDV (out), PHY_RXER (out), PHY_TXC (in), PHY_TXD0 (in), PHY_TXD1 (in), PHY_TXD2 (in), PHY_TXD3 (in), PHY_TXEN (in), PHY_TXER (in)

### Nets
1V2_PHY: C89.2 C90.2 C91.2 C92.2 U10.2(VDD_1)
3V3: C84.2 C85.2 C86.2 C87.2 C88.2 C96.2 C97.2 C98.2 D1.4 D2.4 L6.2 R52.2 R53.2 R55.2 R58.2 R63.2 R67.2 U5.1(EN) U5.4(VCC) U10.17(VDDIO)
3V3_A_PHY: C79.2 C80.2 C81.2 C82.2 C83.2 L6.1 U10.3(VDDA_3)
GND: C79.1 C80.1 C81.1 C82.1 C83.1 C84.1 C85.1 C86.1 C87.1 C88.1 C89.1 C90.1 C91.1 C92.1 C93.1 C94.1 C96.1 C97.1 C98.1 D1.1(I/O) D2.1(I/O) R73.1 R77.1 U5.2(GND) U10.1(GND) U10.33(GND) U10.34(GND) U10.35(GND) U10.36(GND) U10.37(GND) U10.38(GND) U10.39(GND) U10.40(GND) U10.41(GND) U10.42(GND)
GND_CHASSIS: C95.1
CONN_ETH_VCOM_TERM: C95.2 R48.1 R49.1 R68.1 R69.1
ETH_TCOM0: C94.2 T1.7(RDCT)
ETH_TCOM1: C93.2 T1.2(TDCT)
PHY_COL: R56.2 ; port PHY_COL
PHY_CONN_RX_N: J2.6 T1.9(RX-)
PHY_CONN_RX_P: J2.3 T1.11(RX+)
PHY_CONN_TX_N: J2.2 T1.14(TX-)
PHY_CONN_TX_P: J2.1 T1.16(TX+)
PHY_CRS: R57.2 ; port PHY_CRS
PHY_INTRP: U10.21(INTRP/PME_N2/NAND_TREE#) ; port PHY_INTRP
PHY_LED: J2.9(LED1_K) J2.11(LED2_K) R63.1 U10.30(LED0/PME_N1/NWAYEN)
PHY_MDC: U10.12(MDC) ; port PHY_MDC
PHY_MDIO: R55.1 U10.11(MDIO) ; port PHY_MDIO
PHY_RST: R52.1 U10.32(~{RST}) ; port PHY_RST
PHY_RX_N: D2.2(VN) T1.8(RD-) U10.4(RXM)
PHY_RX_P: D2.3 T1.6(RD+) U10.5(RXP)
PHY_RXC: R66.2 ; port PHY_RXC
PHY_RXD0: R61.2 R73.2 ; port PHY_RXD0
PHY_RXD1: R62.2 ; port PHY_RXD1
PHY_RXD2: R64.2 ; port PHY_RXD2
PHY_RXD3: R65.2 ; port PHY_RXD3
PHY_RXDV: R59.2 ; port PHY_RXDV
PHY_RXER: R60.2 ; port PHY_RXER
PHY_TX_N: D1.2(VN) T1.3(TD-) U10.6(TXM)
PHY_TX_P: D1.3 T1.1(TD+) U10.7(TXP)
PHY_TXC: R53.1 U10.22(TXC/PME_EN) ; port PHY_TXC
PHY_TXD0: U10.24(TXD0) ; port PHY_TXD0
PHY_TXD1: U10.25(TXD1) ; port PHY_TXD1
PHY_TXD2: U10.26(TXD2) ; port PHY_TXD2
PHY_TXD3: U10.27(TXD3) ; port PHY_TXD3
PHY_TXEN: U10.23(TXEN) ; port PHY_TXEN
PHY_TXER: U10.31(TXER) ; port PHY_TXER
NetJ2_4: J2.4 J2.5 R68.2
NetJ2_7: J2.7 J2.8 R69.2
NetJ2_10: J2.10(LED1_A) R58.1
NetJ2_12: J2.12(LED2_A) R67.1
NetR48_2: R48.2 T1.15(TXCT)
NetR49_2: R49.2 T1.10(RXCT)
NetR56_1: R56.1 U10.28(COL/CONFIG0)
NetR57_1: R57.1 U10.29(CRS/CONFIG1)
NetR59_1: R59.1 U10.18(RXDV/CONGIG2)
NetR60_1: R60.1 U10.20(RXER/ISO)
NetR61_1: R61.1 U10.16(RXD0/DUPLEX)
NetR62_1: R62.1 U10.15(RXD1/PHYAD2)
NetR64_1: R64.1 U10.14(RXD2/PHYAD1)
NetR65_1: R65.1 U10.13(RXD3/PHYAD0)
NetR66_1: R66.1 U10.19(RXC/B-CAST_OFF)
NetR77_2: R77.2 U10.10(REXT)
NetU5_3: U5.3(OUT) U10.9(XI)

Not connected (* = marked no-connect by the designer): T1 4(NC)* 5(NC)* 12(NC)* 13(NC)*; U10 8(XO)*

### Layout directives
differential pair: PHY_CONN_RX_N, PHY_CONN_RX_P, PHY_CONN_TX_N, PHY_CONN_TX_P, PHY_RX_N, PHY_RX_P, PHY_TX_N, PHY_TX_P
net class PHY_TO_FPGA: (no net found under the mark)
net class ETH_DIFF_CHASSIS: PHY_CONN_RX_N, PHY_CONN_RX_P, PHY_CONN_TX_N, PHY_CONN_TX_P
net class ETH_DIFF_GND: PHY_RX_N, PHY_RX_P, PHY_TX_N, PHY_TX_P

### Notes on the sheet
- Capa -For small impedance
- purpose to avoid overcharging supply
- (near L6) 225R @ 25MHz
- 600R @ 100MHz
- 155 uV for 0.1 uS
- 55 uV for 0.1 uS
- (near R48) Ethernet standard/See Fig 11-1
- (near T1) FOR ESD PURPOSE
- FOR DECOUPLING : Table 3-9 and Figure 3-15
- CHIP POWER : VDDIO@3.3V = 155mW 100BASE-TX Full-duplex @ 100% utilization (Table 3-10)
- (near R58) LED pin drives 8mA typ.
- (near R58) (Table 6-1 LED OUTPUT)
- (near U10) Active low
- (near U10) 34mA
- (near U10) 12mA
- See Fig 11-1
- Reccomended value
- (see Table 2-1)
- Pull-up of 1K or pull-down of 4.7k should be added on config pin (under note 2-3)
- Sheet Name
- Project Title
- Global Project
- Size
- Group
- Revision
- Date
- Sheet
- of
- Filename
- Designers

### Library data of the parts
C79 C84 = CAP - 0603: Precision: 10%; Current: *; CreatedBy: Jonathan Bouchard; Power: *
C80-C83 C85-C94 C96-C98 = CAP - 0402: Precision: 10%; Current: *; CreatedBy: Jonathan Bouchard; Power: *
C95 = CAP - 1206: Precision: 10%; Current: *; CreatedBy: Jonathan Bouchard; Power: *
D1 D2 = TVS_SR3.3.TCT: TVS - DIODE ARRAY 3.3V 150W - SOT143-4; Mfg: Semtech; Voltage: VBR=3.3V; Current: *; Mfg Part Number: SR3.3.TCT; HelpURL: http://www.semtech.com/images/datasheet/sr3.3.pdf; CreatedBy: Jonathan Bouchard; Temperature: -55°C to 125°C; Power: 150W; Package: SOT143-4; Precision: *; Value: *; Supplier 1: Digikey; Supplier Part Number 1: SR3.3DKR-ND
J2 = CONN_ETHERNET_RJHSE-5385: CONN - MOD JACK RJ45 R/A ETHERNET - TH; Mfg: Amphenol; Voltage: *; Current: *; Power: *; Mfg Part Number: RJHSE-5385; HelpURL: https://www.amphenolcanada.com/ProductSearch/drawings/AC/RJHSE538X.pdf; CreatedBy: Jonathan Bouchard; Temperature: -55°C ~ 85°C; Value: *; Precision: *; Package: TH-12; Supplier 1: Digikey; Supplier Part Number 1: RJHSE-5385-ND
R48 R49 R52 R53 R55-R69 R73 R77 = RES - 0402: Voltage: 50V; Power: 1/16W; Current: *; CreatedBy: Jonathan Bouchard
T1 = TRANSFO_H1102NLT: TRANSFO - ETHERNET 10/100B-TX - SMD-16; Mfg: Pulse Eng.; Value: 1:1 (350uH); Voltage: *; Current: *; Power: *; Mfg Part Number: H1102NLT; HelpURL: http://media.digikey.com/pdf/Data%20Sheets/Pulse%20PDFs/10_100BASE-T%20Single%20Port%20SMD%20Magnetics_Rev2008.pdf; CreatedBy: Jonathan Bouchard; Temperature: -40°C to 85°C; Precision: *; Package: SMD-16; Supplier 1: Digikey; Supplier Part Number 1: 553-1532-1-ND
U10 = COM_ETH_PHY_KSZ8091MNXCA: COM - ETHERNET PHY 10/100 - QFN-32; Voltage: 1.8V, 2.5V, 3.3V; Mfg: Micrel; Current: *; Power: *; Mfg Part Number: KSZ8091MNXCA; HelpURL: http://ww1.microchip.com/downloads/en/DeviceDoc/00002275A.pdf; CreatedBy: Jonathan Bouchard; Temperature: 0°C ~ 70°C; Value: *; Precision: *; Package: QFN-32; Supplier 1: Digikey; Supplier Part Number 1: 576-4356-ND
L6 = FER - 0402: Voltage: *; CreatedBy: Jonathan Bouchard; Power: *; Precision: *

## Sheet CM_FMC-HPC-AB.SchDoc
size Tabloid; SheetNumber: 12; SheetTotal: 14; Sheet_Name: CM_FMC-HPC-AB; Size: 11x17
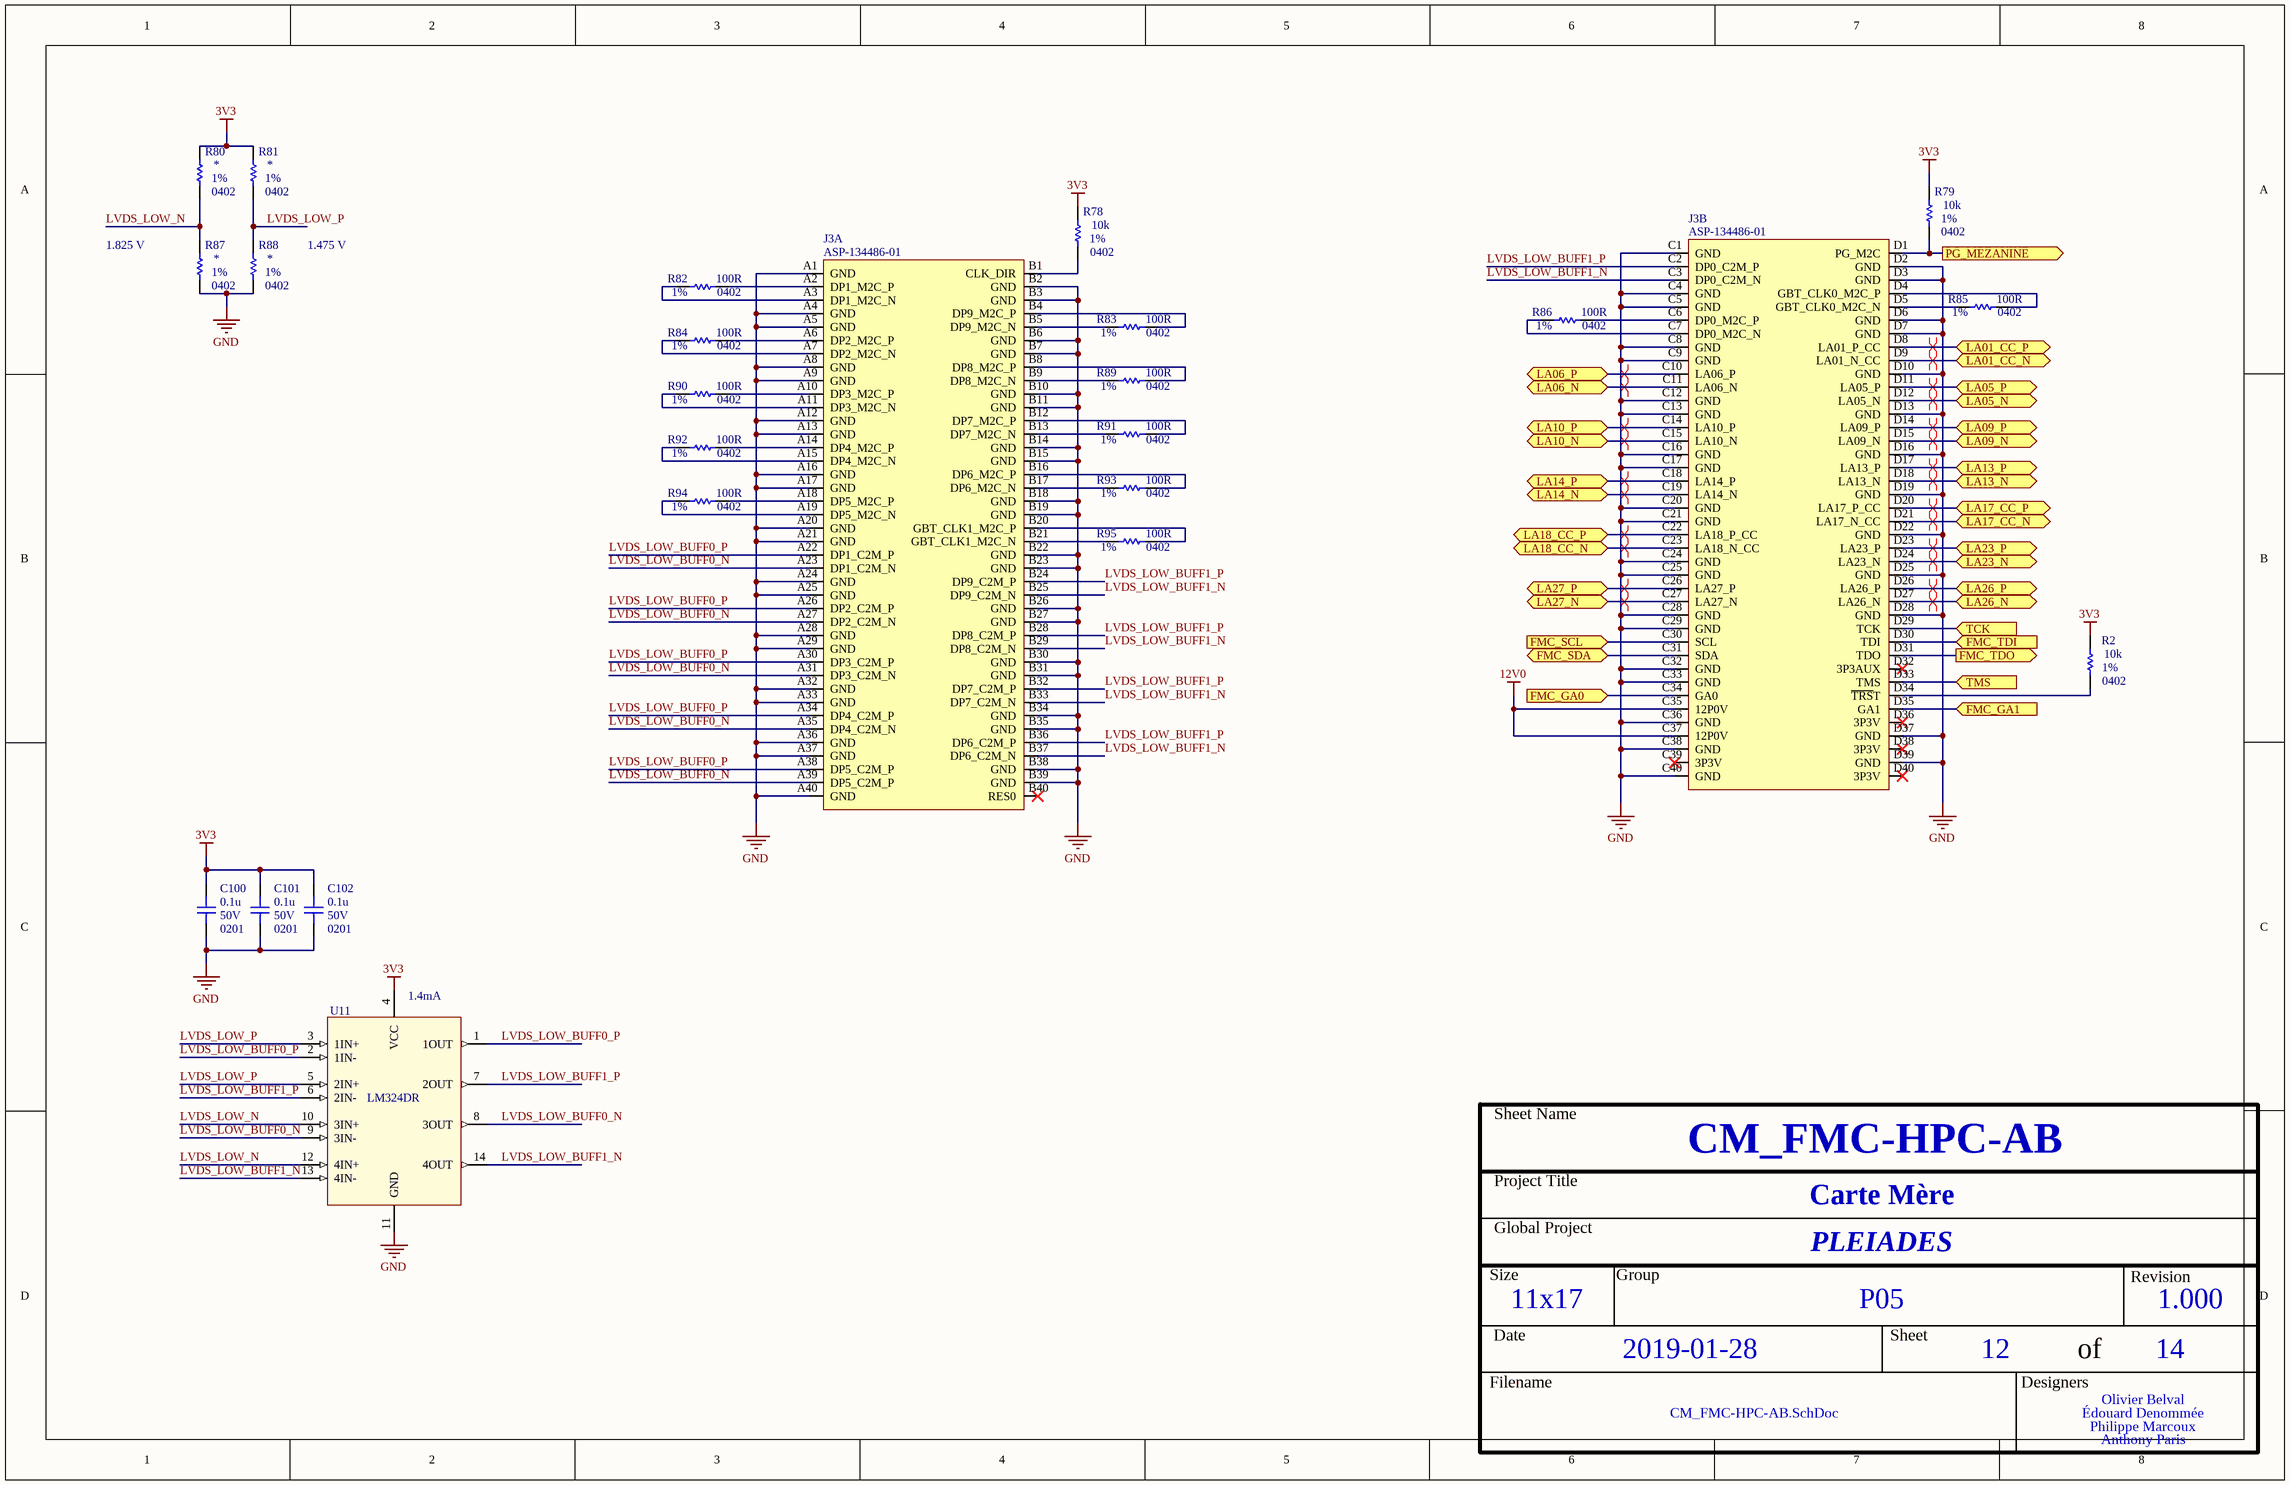
[diagram p11: CM_FMC-HPC-AB.SchDoc]

### Parts
C100  value 0.1u  Voltage: 50V  Package: 0201  [CAP_0201]  (hidden comment: CAP - 0201)
C101  value 0.1u  Voltage: 50V  Package: 0201  [CAP_0201]  (hidden comment: CAP - 0201)
C102  value 0.1u  Voltage: 50V  Package: 0201  [CAP_0201]  (hidden comment: CAP - 0201)
J3  ASP-134486-01  [CONN_SAMTEC_ASP-134486-01]  (parts A,B of 5)
R2  value 10k  Package: 0402  Precision: 1%  [RES_0402]  (hidden comment: RES - 0402)
R78  value 10k  Package: 0402  Precision: 1%  [RES_0402]  (hidden comment: RES - 0402)
R79  value 10k  Package: 0402  Precision: 1%  [RES_0402]  (hidden comment: RES - 0402)
R80  Package: 0402  Precision: 1%  [RES_0402]  (hidden comment: RES - 0402)
R81  Package: 0402  Precision: 1%  [RES_0402]  (hidden comment: RES - 0402)
R82  value 100R  Package: 0402  Precision: 1%  [RES_0402]  (hidden comment: RES - 0402)
R83  value 100R  Package: 0402  Precision: 1%  [RES_0402]  (hidden comment: RES - 0402)
R84  value 100R  Package: 0402  Precision: 1%  [RES_0402]  (hidden comment: RES - 0402)
R85  value 100R  Package: 0402  Precision: 1%  [RES_0402]  (hidden comment: RES - 0402)
R86  value 100R  Package: 0402  Precision: 1%  [RES_0402]  (hidden comment: RES - 0402)
R87  Package: 0402  Precision: 1%  [RES_0402]  (hidden comment: RES - 0402)
R88  Package: 0402  Precision: 1%  [RES_0402]  (hidden comment: RES - 0402)
R89  value 100R  Package: 0402  Precision: 1%  [RES_0402]  (hidden comment: RES - 0402)
R90  value 100R  Package: 0402  Precision: 1%  [RES_0402]  (hidden comment: RES - 0402)
R91  value 100R  Package: 0402  Precision: 1%  [RES_0402]  (hidden comment: RES - 0402)
R92  value 100R  Package: 0402  Precision: 1%  [RES_0402]  (hidden comment: RES - 0402)
R93  value 100R  Package: 0402  Precision: 1%  [RES_0402]  (hidden comment: RES - 0402)
R94  value 100R  Package: 0402  Precision: 1%  [RES_0402]  (hidden comment: RES - 0402)
R95  value 100R  Package: 0402  Precision: 1%  [RES_0402]  (hidden comment: RES - 0402)
U11  LM324DR  [SOIC127P600X175-14N]

### Ports
FMC_GA0 (in), FMC_GA1 (in), FMC_SCL (in), FMC_SDA (bidir), FMC_TDI (in), FMC_TDO (out), LA01_CC_N (bidir), LA01_CC_P (bidir), LA05_N (bidir), LA05_P (bidir), LA06_N (bidir), LA06_P (bidir), LA09_N (bidir), LA09_P (bidir), LA10_N (bidir), LA10_P (bidir), LA13_N (bidir), LA13_P (bidir), LA14_N (bidir), LA14_P (bidir), LA17_CC_N (bidir), LA17_CC_P (bidir), LA18_CC_N (bidir), LA18_CC_P (bidir), LA23_N (bidir), LA23_P (bidir), LA26_N (bidir), LA26_P (bidir), LA27_N (bidir), LA27_P (bidir), PG_MEZANINE (out), TCK (in), TMS (in)

### Nets
3V3: C100.2 C101.2 C102.2 R2.2 R78.2 R79.2 R80.2 R81.2 U11.4(VCC)
12V0: J3.C35(12P0V) J3.C37(12P0V)
GND: C100.1 C101.1 C102.1 J3.A1(GND) J3.A4(GND) J3.A5(GND) J3.A8(GND) J3.A9(GND) J3.A12(GND) J3.A13(GND) J3.A16(GND) J3.A17(GND) J3.A20(GND) J3.A21(GND) J3.A24(GND) J3.A25(GND) J3.A28(GND) J3.A29(GND) J3.A32(GND) J3.A33(GND) J3.A36(GND) J3.A37(GND) J3.A40(GND) J3.B2(GND) J3.B3(GND) J3.B6(GND) J3.B7(GND) J3.B10(GND) J3.B11(GND) J3.B14(GND) J3.B15(GND) J3.B18(GND) J3.B19(GND) J3.B22(GND) J3.B23(GND) J3.B26(GND) J3.B27(GND) J3.B30(GND) J3.B31(GND) J3.B34(GND) J3.B35(GND) J3.B38(GND) J3.B39(GND) J3.C1(GND) J3.C4(GND) J3.C5(GND) J3.C8(GND) J3.C9(GND) J3.C12(GND) J3.C13(GND) J3.C16(GND) J3.C17(GND) J3.C20(GND) J3.C21(GND) J3.C24(GND) J3.C25(GND) J3.C28(GND) J3.C29(GND) J3.C32(GND) J3.C33(GND) J3.C36(GND) J3.C38(GND) J3.C40(GND) J3.D2(GND) J3.D3(GND) J3.D6(GND) J3.D7(GND) J3.D10(GND) J3.D13(GND) J3.D16(GND) J3.D19(GND) J3.D22(GND) J3.D25(GND) J3.D28(GND) J3.D37(GND) J3.D39(GND) R87.1 R88.1 U11.11(GND)
FMC_GA0: J3.C34(GA0) ; port FMC_GA0
FMC_GA1: J3.D35(GA1) ; port FMC_GA1
FMC_SCL: J3.C30(SCL) ; port FMC_SCL
FMC_SDA: J3.C31(SDA) ; port FMC_SDA
FMC_TDI: J3.D30(TDI) ; port FMC_TDI
FMC_TDO: J3.D31(TDO) ; port FMC_TDO
LA01_CC_N: J3.D9(LA01_N_CC) ; port LA01_CC_N
LA01_CC_P: J3.D8(LA01_P_CC) ; port LA01_CC_P
LA05_N: J3.D12(LA05_N) ; port LA05_N
LA05_P: J3.D11(LA05_P) ; port LA05_P
LA06_N: J3.C11(LA06_N) ; port LA06_N
LA06_P: J3.C10(LA06_P) ; port LA06_P
LA09_N: J3.D15(LA09_N) ; port LA09_N
LA09_P: J3.D14(LA09_P) ; port LA09_P
LA10_N: J3.C15(LA10_N) ; port LA10_N
LA10_P: J3.C14(LA10_P) ; port LA10_P
LA13_N: J3.D18(LA13_N) ; port LA13_N
LA13_P: J3.D17(LA13_P) ; port LA13_P
LA14_N: J3.C19(LA14_N) ; port LA14_N
LA14_P: J3.C18(LA14_P) ; port LA14_P
LA17_CC_N: J3.D21(LA17_N_CC) ; port LA17_CC_N
LA17_CC_P: J3.D20(LA17_P_CC) ; port LA17_CC_P
LA18_CC_N: J3.C23(LA18_N_CC) ; port LA18_CC_N
LA18_CC_P: J3.C22(LA18_P_CC) ; port LA18_CC_P
LA23_N: J3.D24(LA23_N) ; port LA23_N
LA23_P: J3.D23(LA23_P) ; port LA23_P
LA26_N: J3.D27(LA26_N) ; port LA26_N
LA26_P: J3.D26(LA26_P) ; port LA26_P
LA27_N: J3.C27(LA27_N) ; port LA27_N
LA27_P: J3.C26(LA27_P) ; port LA27_P
LVDS_LOW_BUFF0_N: J3.A23(DP1_C2M_N) J3.A27(DP2_C2M_N) J3.A31(DP3_C2M_N) J3.A35(DP4_C2M_N) J3.A39(DP5_C2M_P) U11.8(3OUT) U11.9(3IN-)
LVDS_LOW_BUFF0_P: J3.A22(DP1_C2M_P) J3.A26(DP2_C2M_P) J3.A30(DP3_C2M_P) J3.A34(DP4_C2M_P) J3.A38(DP5_C2M_P) U11.1(1OUT) U11.2(1IN-)
LVDS_LOW_BUFF1_N: J3.B25(DP9_C2M_N) J3.B29(DP8_C2M_N) J3.B33(DP7_C2M_N) J3.B37(DP6_C2M_N) J3.C3(DP0_C2M_N) U11.13(4IN-) U11.14(4OUT)
LVDS_LOW_BUFF1_P: J3.B24(DP9_C2M_P) J3.B28(DP8_C2M_P) J3.B32(DP7_C2M_P) J3.B36(DP6_C2M_P) J3.C2(DP0_C2M_P) U11.6(2IN-) U11.7(2OUT)
LVDS_LOW_N: R80.1 R87.2 U11.10(3IN+) U11.12(4IN+)
LVDS_LOW_P: R81.1 R88.2 U11.3(1IN+) U11.5(2IN+)
PG_MEZANINE: J3.D1(PG_M2C) R79.1 ; port PG_MEZANINE
TCK: J3.D29(TCK) ; port TCK
TMS: J3.D33(TMS) ; port TMS
NetJ3_A2: J3.A2(DP1_M2C_P) R82.1
NetJ3_A3: J3.A3(DP1_M2C_N) R82.2
NetJ3_A6: J3.A6(DP2_M2C_P) R84.1
NetJ3_A7: J3.A7(DP2_M2C_N) R84.2
NetJ3_A10: J3.A10(DP3_M2C_P) R90.1
NetJ3_A11: J3.A11(DP3_M2C_N) R90.2
NetJ3_A14: J3.A14(DP4_M2C_P) R92.1
NetJ3_A15: J3.A15(DP4_M2C_N) R92.2
NetJ3_A18: J3.A18(DP5_M2C_P) R94.1
NetJ3_A19: J3.A19(DP5_M2C_N) R94.2
NetJ3_B1: J3.B1(CLK_DIR) R78.1
NetJ3_B4: J3.B4(DP9_M2C_P) R83.2
NetJ3_B5: J3.B5(DP9_M2C_N) R83.1
NetJ3_B8: J3.B8(DP8_M2C_P) R89.2
NetJ3_B9: J3.B9(DP8_M2C_N) R89.1
NetJ3_B12: J3.B12(DP7_M2C_P) R91.2
NetJ3_B13: J3.B13(DP7_M2C_N) R91.1
NetJ3_B16: J3.B16(DP6_M2C_P) R93.2
NetJ3_B17: J3.B17(DP6_M2C_N) R93.1
NetJ3_B20: J3.B20(GBT_CLK1_M2C_P) R95.2
NetJ3_B21: J3.B21(GBT_CLK1_M2C_N) R95.1
NetJ3_C6: J3.C6(DP0_M2C_P) R86.1
NetJ3_C7: J3.C7(DP0_M2C_N) R86.2
NetJ3_D4: J3.D4(GBT_CLK0_M2C_P) R85.2
NetJ3_D5: J3.D5(GBT_CLK0_M2C_N) R85.1
NetJ3_D34: J3.D34(~{TRS}T) R2.1

Not connected (* = marked no-connect by the designer): J3 B40(RES0)* C39(3P3V)* D32(3P3AUX)* D36(3P3V)* D38(3P3V)* D40(3P3V)*

### Layout directives
differential pair: LA01_CC_N, LA01_CC_P, LA05_N, LA05_P, LA06_N, LA06_P, LA09_N, LA09_P, LA10_N, LA10_P, LA13_N, LA13_P, LA14_N, LA14_P, LA17_CC_N, LA17_CC_P, LA18_CC_N, LA18_CC_P, LA23_N, LA23_P, LA26_N, LA26_P, LA27_N, LA27_P

### Notes on the sheet
- 1.825 V
- 1.475 V
- (near U11) 1.4mA
- Sheet Name
- Project Title
- Global Project
- Size
- Group
- Revision
- Date
- Sheet
- of
- Filename
- Designers

### Library data of the parts
C100-C102 = CAP - 0201: Precision: 10%; Current: *; CreatedBy: Jonathan Bouchard; Power: *
J3 = CONN_SAMTEC_ASP-134486-01: CONN - VITA 57 MEZZ FEMALE (MOTHERBOARD) HIGH DENSITY - SMD-400; Voltage: 240VAC; Current: 1.8A; Mfg: Samtec; Power: *; Mfg Part Number: ASP-134486-01; HelpURL: http://suddendocs.samtec.com/prints/asp-134486-01-mkt.pdf; CreatedBy: Jonathan Bouchard; Temperature: -55 °C to +125 °C; Value: *; Precision: *; Package: SMD-400
R2 R78-R95 = RES - 0402: Voltage: 50V; Power: 1/16W; Current: *; CreatedBy: Jonathan Bouchard
  R80 R81 R87 R88: Value: *
U11 = LM324DR: OP Amp Quad GP Â±16V/32V 14-Pin SOIC T/R; MF: Rohm; Digi-Key_Purchase_URL: https://www.digikey.ca/product-detail/en/rohm-semiconductor/LM324DR/LM324DRRS-ND/4003944?utm_source=snapeda&utm_medium=aggregator&utm_campaign=symbol; SnapEDA_Link: https://www.snapeda.com/parts/LM324DR/Rohm/view-part/?ref=snap; Digi-Key_Part_Number: LM324DRRS-ND; Package: SOIC-14 Rohm; MP: LM324DR; Value: *

## Sheet CM_FMC-HPC-CDE.SchDoc
size Tabloid; SheetNumber: 13; SheetTotal: 14; Sheet_Name: CM_FMC-HPC-CDE; Size: 11x17
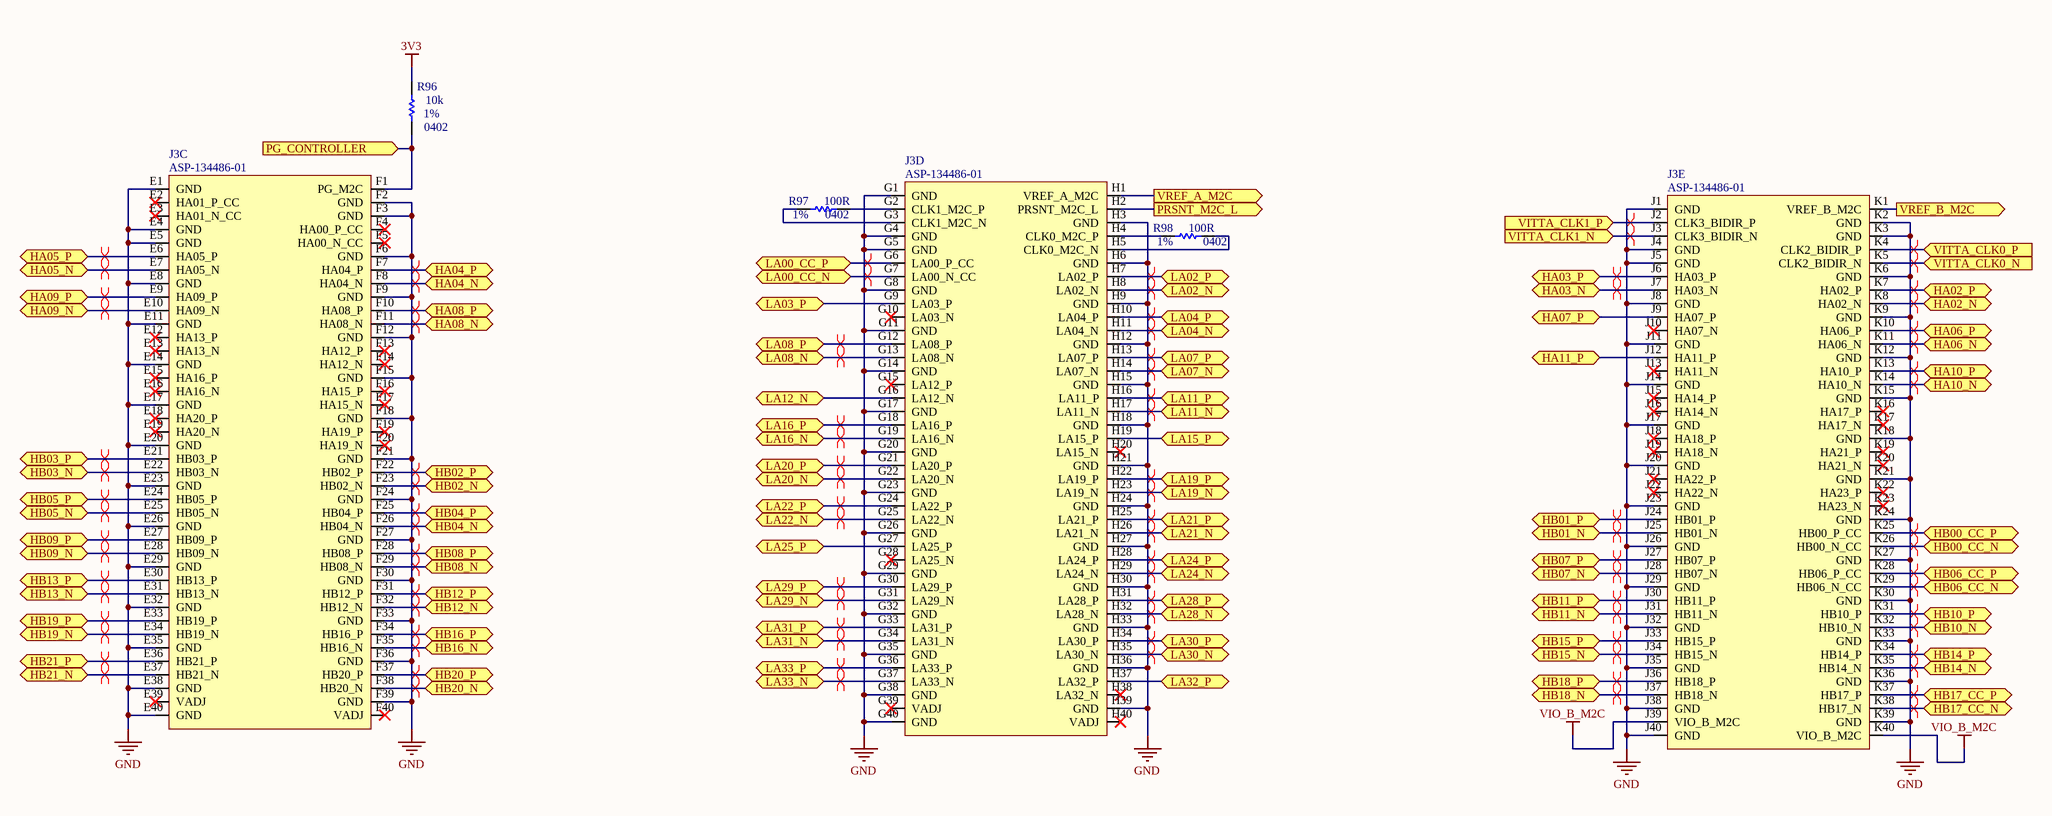
[diagram p12: CM_FMC-HPC-CDE.SchDoc]

### Parts
J3  ASP-134486-01  [CONN_SAMTEC_ASP-134486-01]  (parts C,D,E of 5)
R96  value 10k  Package: 0402  Precision: 1%  [RES_0402]  (hidden comment: RES - 0402)
R97  value 100R  Package: 0402  Precision: 1%  [RES_0402]  (hidden comment: RES - 0402)
R98  value 100R  Package: 0402  Precision: 1%  [RES_0402]  (hidden comment: RES - 0402)

### Ports
HA02_N (bidir), HA02_P (bidir), HA03_N (bidir), HA03_P (bidir), HA04_N (bidir), HA04_P (bidir), HA05_N (bidir), HA05_P (bidir), HA06_N (bidir), HA06_P (bidir), HA07_P (bidir), HA08_N (bidir), HA08_P (bidir), HA09_N (bidir), HA09_P (bidir), HA10_N (bidir), HA10_P (bidir), HA11_P (bidir), HB00_CC_N (bidir), HB00_CC_P (bidir), HB01_N (bidir), HB01_P (bidir), HB02_N (bidir), HB02_P (bidir), HB03_N (bidir), HB03_P (bidir), HB04_N (bidir), HB04_P (bidir), HB05_N (bidir), HB05_P (bidir), HB06_CC_N (bidir), HB06_CC_P (bidir), HB07_N (bidir), HB07_P (bidir), HB08_N (bidir), HB08_P (bidir), HB09_N (bidir), HB09_P (bidir), HB10_N (bidir), HB10_P (bidir), HB11_N (bidir), HB11_P (bidir), HB12_N (bidir), HB12_P (bidir), HB13_N (bidir), HB13_P (bidir), HB14_N (bidir), HB14_P (bidir), HB15_N (bidir), HB15_P (bidir), HB16_N (bidir), HB16_P (bidir), HB17_CC_N (bidir), HB17_CC_P (bidir), HB18_N (bidir), HB18_P (bidir), HB19_N (bidir), HB19_P (bidir), HB20_N (bidir), HB20_P (bidir), HB21_N (bidir), HB21_P (bidir), LA00_CC_N (bidir), LA00_CC_P (bidir), LA02_N (bidir), LA02_P (bidir), LA03_P (bidir), LA04_N (bidir), LA04_P (bidir), LA07_N (bidir), LA07_P (bidir), LA08_N (bidir), LA08_P (bidir), LA11_N (bidir), LA11_P (bidir), LA12_N (bidir), LA15_P (bidir), LA16_N (bidir), LA16_P (bidir), LA19_N (bidir), LA19_P (bidir), LA20_N (bidir), LA20_P (bidir), LA21_N (bidir), LA21_P (bidir), LA22_N (bidir), LA22_P (bidir), LA24_N (bidir), LA24_P (bidir), LA25_P (bidir), LA28_N (bidir), LA28_P (bidir), LA29_N (bidir), LA29_P (bidir), LA30_N (bidir), LA30_P (bidir), LA31_N (bidir), LA31_P (bidir), LA32_P (bidir), LA33_N (bidir), LA33_P (bidir), PG_CONTROLLER (in), PRSNT_M2C_L (out), VITTA_CLK0_N (in), VITTA_CLK0_P (in), VITTA_CLK1_N (in), VITTA_CLK1_P (in), VREF_A_M2C (out), VREF_B_M2C (out)

### Nets
3V3: R96.2
GND: J3.E1(GND) J3.E4(GND) J3.E5(GND) J3.E8(GND) J3.E11(GND) J3.E14(GND) J3.E17(GND) J3.E20(GND) J3.E23(GND) J3.E26(GND) J3.E29(GND) J3.E32(GND) J3.E35(GND) J3.E38(GND) J3.E40(GND) J3.F2(GND) J3.F3(GND) J3.F6(GND) J3.F9(GND) J3.F12(GND) J3.F15(GND) J3.F18(GND) J3.F21(GND) J3.F24(GND) J3.F27(GND) J3.F30(GND) J3.F33(GND) J3.F36(GND) J3.F39(GND) J3.G1(GND) J3.G4(GND) J3.G5(GND) J3.G8(GND) J3.G11(GND) J3.G14(GND) J3.G17(GND) J3.G20(GND) J3.G23(GND) J3.G26(GND) J3.G29(GND) J3.G32(GND) J3.G35(GND) J3.G38(GND) J3.G40(GND) J3.H3(GND) J3.H6(GND) J3.H9(GND) J3.H12(GND) J3.H15(GND) J3.H18(GND) J3.H21(GND) J3.H24(GND) J3.H27(GND) J3.H30(GND) J3.H33(GND) J3.H36(GND) J3.H39(GND) J3.J1(GND) J3.J4(GND) J3.J5(GND) J3.J8(GND) J3.J11(GND) J3.J14(GND) J3.J17(GND) J3.J20(GND) J3.J23(GND) J3.J26(GND) J3.J29(GND) J3.J32(GND) J3.J35(GND) J3.J38(GND) J3.J40(GND) J3.K2(GND) J3.K3(GND) J3.K6(GND) J3.K9(GND) J3.K12(GND) J3.K15(GND) J3.K18(GND) J3.K21(GND) J3.K24(GND) J3.K27(GND) J3.K30(GND) J3.K33(GND) J3.K36(GND) J3.K39(GND)
VIO_B_M2C: J3.J39(VIO_B_M2C) J3.K40(VIO_B_M2C)
HA02_N: J3.K8(HA02_N) ; port HA02_N
HA02_P: J3.K7(HA02_P) ; port HA02_P
HA03_N: J3.J7(HA03_N) ; port HA03_N
HA03_P: J3.J6(HA03_P) ; port HA03_P
HA04_N: J3.F8(HA04_N) ; port HA04_N
HA04_P: J3.F7(HA04_P) ; port HA04_P
HA05_N: J3.E7(HA05_N) ; port HA05_N
HA05_P: J3.E6(HA05_P) ; port HA05_P
HA06_N: J3.K11(HA06_N) ; port HA06_N
HA06_P: J3.K10(HA06_P) ; port HA06_P
HA07_P: J3.J9(HA07_P) ; port HA07_P
HA08_N: J3.F11(HA08_N) ; port HA08_N
HA08_P: J3.F10(HA08_P) ; port HA08_P
HA09_N: J3.E10(HA09_N) ; port HA09_N
HA09_P: J3.E9(HA09_P) ; port HA09_P
HA10_N: J3.K14(HA10_N) ; port HA10_N
HA10_P: J3.K13(HA10_P) ; port HA10_P
HA11_P: J3.J12(HA11_P) ; port HA11_P
HB00_CC_N: J3.K26(HB00_N_CC) ; port HB00_CC_N
HB00_CC_P: J3.K25(HB00_P_CC) ; port HB00_CC_P
HB01_N: J3.J25(HB01_N) ; port HB01_N
HB01_P: J3.J24(HB01_P) ; port HB01_P
HB02_N: J3.F23(HB02_N) ; port HB02_N
HB02_P: J3.F22(HB02_P) ; port HB02_P
HB03_N: J3.E22(HB03_N) ; port HB03_N
HB03_P: J3.E21(HB03_P) ; port HB03_P
HB04_N: J3.F26(HB04_N) ; port HB04_N
HB04_P: J3.F25(HB04_P) ; port HB04_P
HB05_N: J3.E25(HB05_N) ; port HB05_N
HB05_P: J3.E24(HB05_P) ; port HB05_P
HB06_CC_N: J3.K29(HB06_N_CC) ; port HB06_CC_N
HB06_CC_P: J3.K28(HB06_P_CC) ; port HB06_CC_P
HB07_N: J3.J28(HB07_N) ; port HB07_N
HB07_P: J3.J27(HB07_P) ; port HB07_P
HB08_N: J3.F29(HB08_N) ; port HB08_N
HB08_P: J3.F28(HB08_P) ; port HB08_P
HB09_N: J3.E28(HB09_N) ; port HB09_N
HB09_P: J3.E27(HB09_P) ; port HB09_P
HB10_N: J3.K32(HB10_N) ; port HB10_N
HB10_P: J3.K31(HB10_P) ; port HB10_P
HB11_N: J3.J31(HB11_N) ; port HB11_N
HB11_P: J3.J30(HB11_P) ; port HB11_P
HB12_N: J3.F32(HB12_N) ; port HB12_N
HB12_P: J3.F31(HB12_P) ; port HB12_P
HB13_N: J3.E31(HB13_N) ; port HB13_N
HB13_P: J3.E30(HB13_P) ; port HB13_P
HB14_N: J3.K35(HB14_N) ; port HB14_N
HB14_P: J3.K34(HB14_P) ; port HB14_P
HB15_N: J3.J34(HB15_N) ; port HB15_N
HB15_P: J3.J33(HB15_P) ; port HB15_P
HB16_N: J3.F35(HB16_N) ; port HB16_N
HB16_P: J3.F34(HB16_P) ; port HB16_P
HB17_CC_N: J3.K38(HB17_N) ; port HB17_CC_N
HB17_CC_P: J3.K37(HB17_P) ; port HB17_CC_P
HB18_N: J3.J37(HB18_N) ; port HB18_N
HB18_P: J3.J36(HB18_P) ; port HB18_P
HB19_N: J3.E34(HB19_N) ; port HB19_N
HB19_P: J3.E33(HB19_P) ; port HB19_P
HB20_N: J3.F38(HB20_N) ; port HB20_N
HB20_P: J3.F37(HB20_P) ; port HB20_P
HB21_N: J3.E37(HB21_N) ; port HB21_N
HB21_P: J3.E36(HB21_P) ; port HB21_P
LA00_CC_N: J3.G7(LA00_N_CC) ; port LA00_CC_N
LA00_CC_P: J3.G6(LA00_P_CC) ; port LA00_CC_P
LA02_N: J3.H8(LA02_N) ; port LA02_N
LA02_P: J3.H7(LA02_P) ; port LA02_P
LA03_P: J3.G9(LA03_P) ; port LA03_P
LA04_N: J3.H11(LA04_N) ; port LA04_N
LA04_P: J3.H10(LA04_P) ; port LA04_P
LA07_N: J3.H14(LA07_N) ; port LA07_N
LA07_P: J3.H13(LA07_P) ; port LA07_P
LA08_N: J3.G13(LA08_N) ; port LA08_N
LA08_P: J3.G12(LA08_P) ; port LA08_P
LA11_N: J3.H17(LA11_N) ; port LA11_N
LA11_P: J3.H16(LA11_P) ; port LA11_P
LA12_N: J3.G16(LA12_N) ; port LA12_N
LA15_P: J3.H19(LA15_P) ; port LA15_P
LA16_N: J3.G19(LA16_N) ; port LA16_N
LA16_P: J3.G18(LA16_P) ; port LA16_P
LA19_N: J3.H23(LA19_N) ; port LA19_N
LA19_P: J3.H22(LA19_P) ; port LA19_P
LA20_N: J3.G22(LA20_N) ; port LA20_N
LA20_P: J3.G21(LA20_P) ; port LA20_P
LA21_N: J3.H26(LA21_N) ; port LA21_N
LA21_P: J3.H25(LA21_P) ; port LA21_P
LA22_N: J3.G25(LA22_N) ; port LA22_N
LA22_P: J3.G24(LA22_P) ; port LA22_P
LA24_N: J3.H29(LA24_N) ; port LA24_N
LA24_P: J3.H28(LA24_P) ; port LA24_P
LA25_P: J3.G27(LA25_P) ; port LA25_P
LA28_N: J3.H32(LA28_N) ; port LA28_N
LA28_P: J3.H31(LA28_P) ; port LA28_P
LA29_N: J3.G31(LA29_N) ; port LA29_N
LA29_P: J3.G30(LA29_P) ; port LA29_P
LA30_N: J3.H35(LA30_N) ; port LA30_N
LA30_P: J3.H34(LA30_P) ; port LA30_P
LA31_N: J3.G34(LA31_N) ; port LA31_N
LA31_P: J3.G33(LA31_P) ; port LA31_P
LA32_P: J3.H37(LA32_P) ; port LA32_P
LA33_N: J3.G37(LA33_N) ; port LA33_N
LA33_P: J3.G36(LA33_P) ; port LA33_P
PG_CONTROLLER: J3.F1(PG_M2C) R96.1 ; port PG_CONTROLLER
PRSNT_M2C_L: J3.H2(PRSNT_M2C_L) ; port PRSNT_M2C_L
VITTA_CLK0_N: J3.K5(CLK2_BIDIR_N) ; port VITTA_CLK0_N
VITTA_CLK0_P: J3.K4(CLK2_BIDIR_P) ; port VITTA_CLK0_P
VITTA_CLK1_N: J3.J3(CLK3_BIDIR_N) ; port VITTA_CLK1_N
VITTA_CLK1_P: J3.J2(CLK3_BIDIR_P) ; port VITTA_CLK1_P
VREF_A_M2C: J3.H1(VREF_A_M2C) ; port VREF_A_M2C
VREF_B_M2C: J3.K1(VREF_B_M2C) ; port VREF_B_M2C
NetJ3_G2: J3.G2(CLK1_M2C_P) R97.1
NetJ3_G3: J3.G3(CLK1_M2C_N) R97.2
NetJ3_H4: J3.H4(CLK0_M2C_P) R98.2
NetJ3_H5: J3.H5(CLK0_M2C_N) R98.1

Not connected (* = marked no-connect by the designer): J3 E2(HA01_P_CC)* E3(HA01_N_CC)* E12(HA13_P)* E13(HA13_N)* E15(HA16_P)* E16(HA16_N)* E18(HA20_P)* E19(HA20_N)* E39(VADJ)* F4(HA00_P_CC)* F5(HA00_N_CC)* F13(HA12_P)* F14(HA12_N)* F16(HA15_P)* F17(HA15_N)* F19(HA19_P)* F20(HA19_N)* F40(VADJ)* G10(LA03_N)* G15(LA12_P)* G28(LA25_N)* G39(VADJ)* H20(LA15_N)* H38(LA32_N)* H40(VADJ)* J10(HA07_N)* J13(HA11_N)* J15(HA14_P)* J16(HA14_N)* J18(HA18_P)* J19(HA18_N)* J21(HA22_P)* J22(HA22_N)* K16(HA17_P)* K17(HA17_N)* K19(HA21_P)* K20(HA21_N)* K22(HA23_P)* K23(HA23_N)*

### Layout directives
differential pair: HA02_N, HA02_P, HA03_N, HA03_P, HA04_N, HA04_P, HA05_N, HA05_P, HA06_N, HA06_P, HA08_N, HA08_P, HA09_N, HA09_P, HA10_N, HA10_P, HB00_CC_N, HB00_CC_P, HB01_N, HB01_P, HB02_N, HB02_P, HB03_N, HB03_P, HB04_N, HB04_P, HB05_N, HB05_P, HB06_CC_N, HB06_CC_P, HB07_N, HB07_P, HB08_N, HB08_P, HB09_N, HB09_P, HB10_N, HB10_P, HB11_N, HB11_P, HB12_N, HB12_P, HB13_N, HB13_P, HB14_N, HB14_P, HB15_N, HB15_P, HB16_N, HB16_P, HB17_CC_N, HB17_CC_P, HB18_N, HB18_P, HB19_N, HB19_P, HB20_N, HB20_P, HB21_N, HB21_P, LA00_CC_N, LA00_CC_P, LA02_N, LA02_P, LA04_N, LA04_P, LA07_N, LA07_P, LA08_N, LA08_P, LA11_N, LA11_P, LA16_N, LA16_P, LA19_N, LA19_P, LA20_N, LA20_P, LA21_N, LA21_P, LA22_N, LA22_P, LA24_N, LA24_P, LA28_N, LA28_P, LA29_N, LA29_P, LA30_N, LA30_P, LA31_N, LA31_P, LA33_N, LA33_P, VITTA_CLK0_N, VITTA_CLK0_P, VITTA_CLK1_N, VITTA_CLK1_P

### Notes on the sheet
- Sheet Name
- Project Title
- Global Project
- Size
- Group
- Revision
- Date
- Sheet
- of
- Filename
- Designers

### Library data of the parts
J3 = CONN_SAMTEC_ASP-134486-01: as J3 on sheet CM_FMC-HPC-AB; Power: *; Mfg Part Number: ASP-134486-01; HelpURL: http://suddendocs.samtec.com/prints/asp-134486-01-mkt.pdf; CreatedBy: Jonathan Bouchard; Temperature: -55 °C to +125 °C; Value: *; Precision: *; Package: SMD-400
R96-R98 = RES - 0402: Voltage: 50V; Power: 1/16W; Current: *; CreatedBy: Jonathan Bouchard